# EAGLE design outdoor-sensor (EAGLE 6.5.0)

## Sheet 1 of 8: Pressure Sensor LPS25H Datasheet <http://www.st.com/st-web-ui/static/active/en/resource/technical/document/datasheet/DM00066332.pdf>
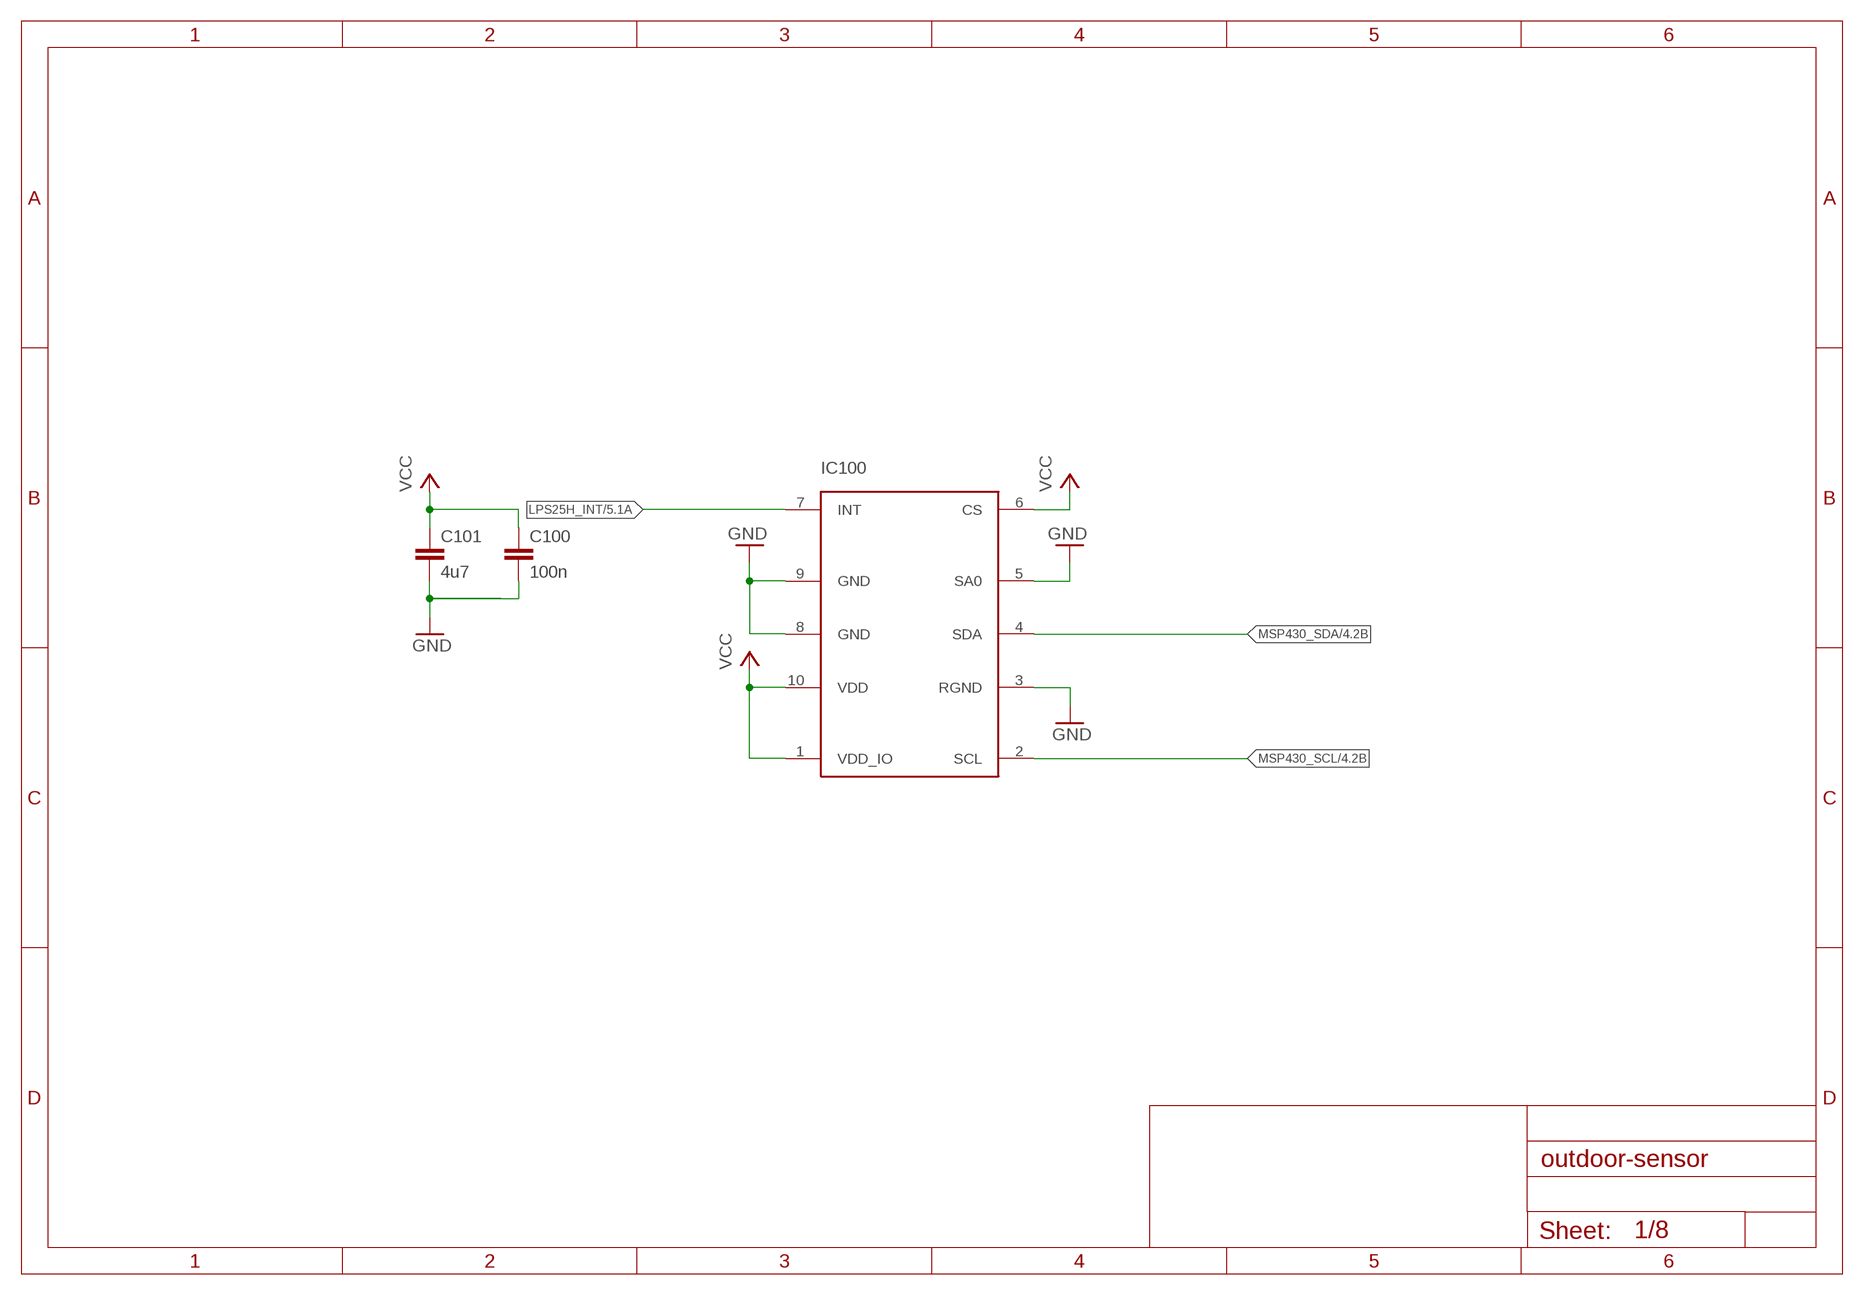
[diagram p0: schematic, sheet 1]

### Parts
C100  100n  C-EUC0603  [C0603]
C101  4u7  C-EUC0603  [C0603]
IC100  LPS25H  [LPS25H]

### Nets
GND: C100.2 C101.2 IC100.3(RGND) IC100.5(SA0) IC100.8(GND) IC100.9(GND) ; also sheet 2,3,4,5,6,7,8
LPS25H_INT: IC100.7(INT) ; also sheet 5
MSP430_SCL: IC100.2(SCL) ; also sheet 4,5,6,8
MSP430_SDA: IC100.4(SDA) ; also sheet 4,5,6,8
VCC: C100.1 C101.1 IC100.1(VDD_IO) IC100.6(CS) IC100.10(VDD) ; also sheet 2,3,4,5,6,8

## Sheet 2 of 8: Charger and Buck BQ25570 Datasheet <http://www.ti.com/lit/ds/symlink/bq25570.pdf>
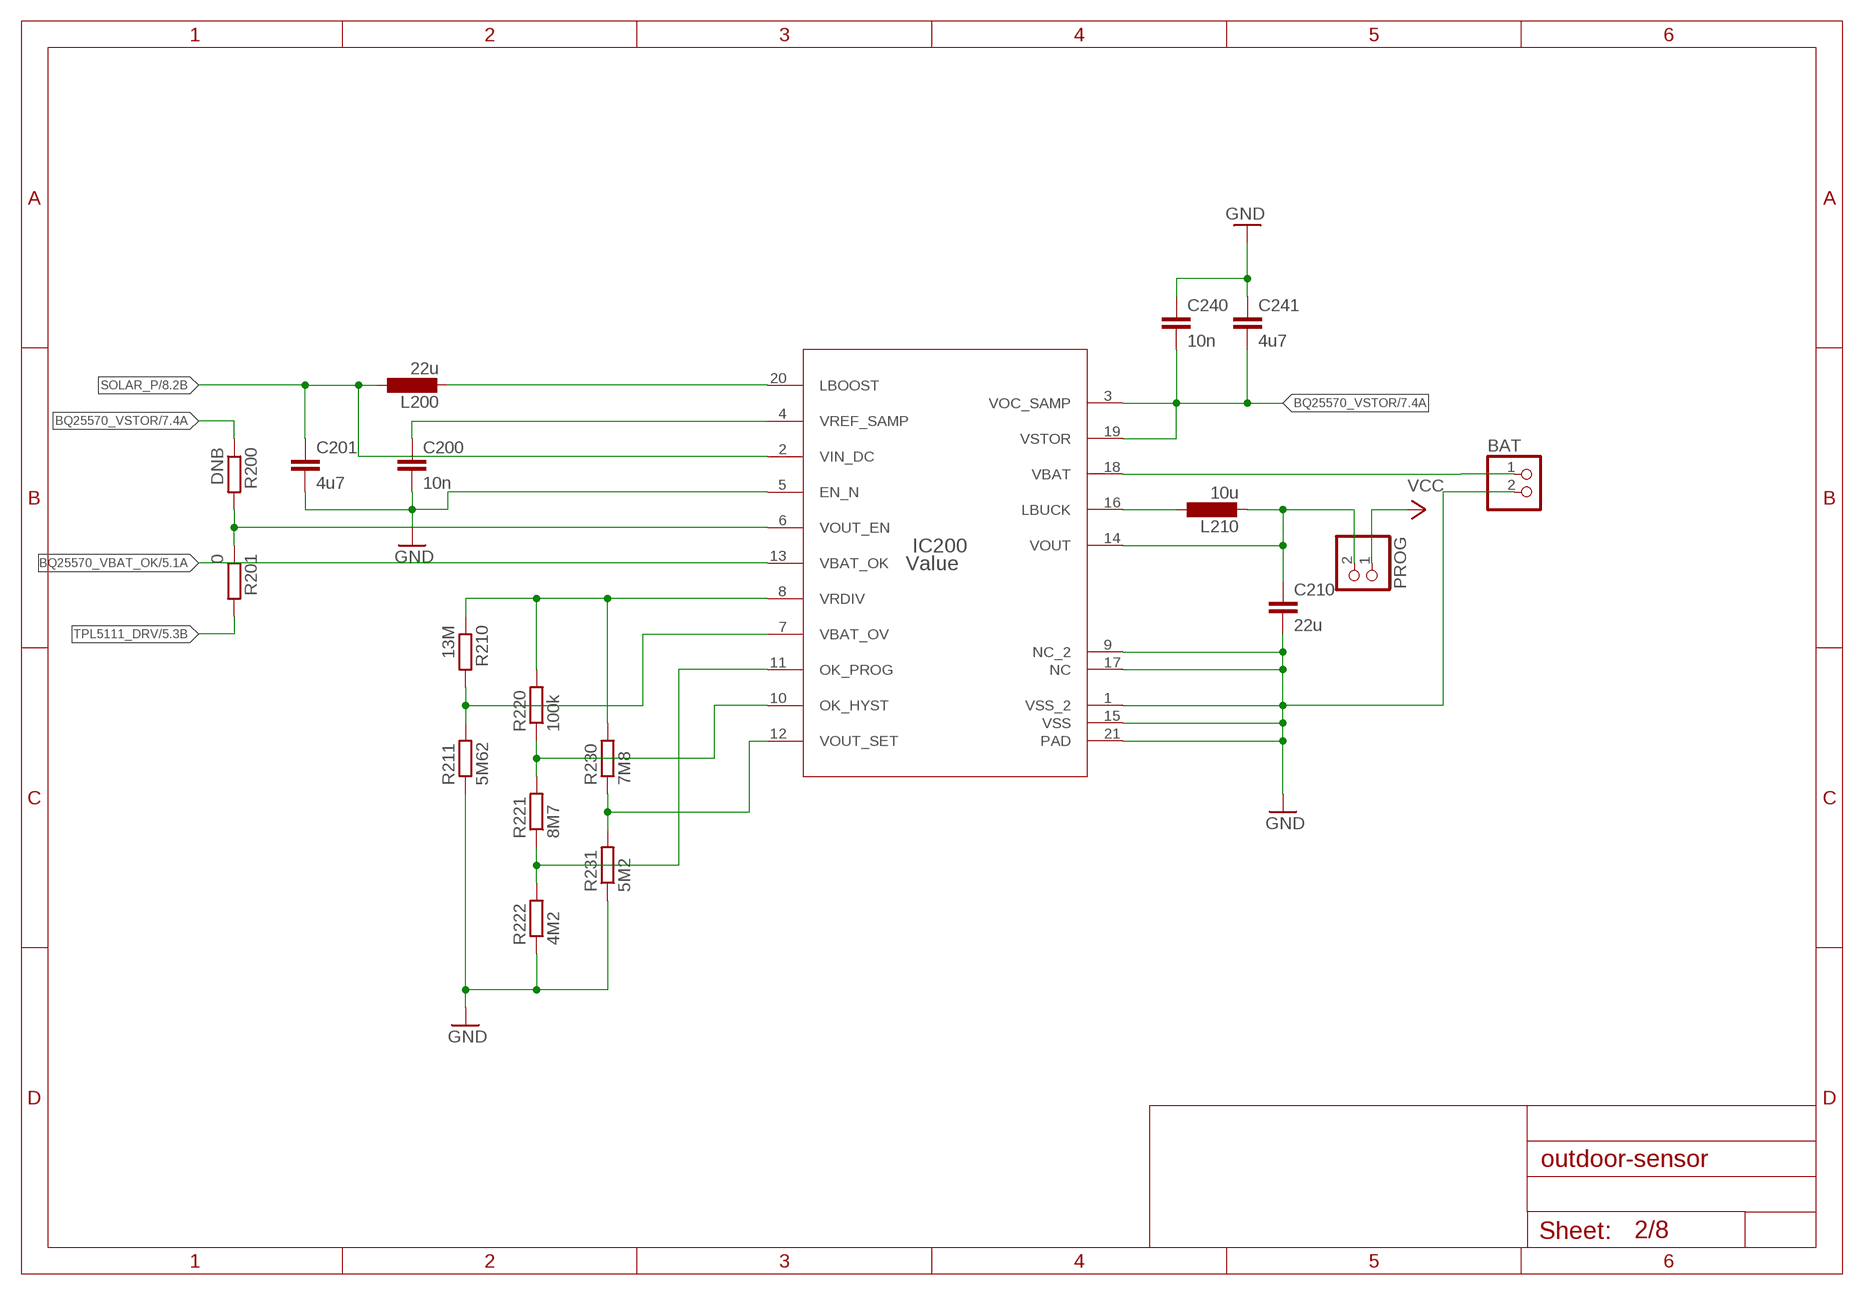
[diagram p1: schematic, sheet 2]

### Parts
!PROG  PINHD-1X2  [1X02]
BAT  PINHD-1X2  [1X02]
C200  10n  C-EUC0603  [C0603]
C201  4u7  C-EUC0603  [C0603]
C210  22u  C-EUC0603  [C0603]
C240  10n  C-EUC0603  [C0603]
C241  4u7  C-EUC0603  [C0603]
IC200  Value  BQ25570RGRR  [RGR0020A]
L200  22u  L-EUL3225P  [L3225P]
L210  10u  L-EUL3225P  [L3225P]
R200  DNB  R-EU_R0603  [R0603]
R201  0  R-EU_R0603  [R0603]
R210  13M  R-EU_R0603  [R0603]
R211  5M62  R-EU_R0603  [R0603]
R220  100k  R-EU_R0603  [R0603]
R221  8M7  R-EU_R0603  [R0603]
R222  4M2  R-EU_R0603  [R0603]
R230  7M8  R-EU_R0603  [R0603]
R231  5M2  R-EU_R0603  [R0603]

### Nets
BQ25570_VBAT_OK: IC200.13(VBAT_OK) ; also sheet 5
BQ25570_VOUT_EN: IC200.6(VOUT_EN) R200.2 R201.1
BQ25570_VSTOR: C240.2 C241.2 IC200.3(VOC_SAMP) IC200.19(VSTOR) R200.1 ; also sheet 7
GND: BAT.2 C200.2 C201.2 C210.2 C240.1 C241.1 IC200.1(VSS_2) IC200.5(EN_N) IC200.9(NC_2) IC200.15(VSS) IC200.17(NC) IC200.21(PAD) R211.1 R222.1 R231.1 ; also sheet 1,3,4,5,6,7,8
N$14: IC200.10(OK_HYST) R220.1 R221.2
N$15: IC200.8(VRDIV) R210.1 R220.2 R230.2
N$16: IC200.7(VBAT_OV) R210.2 R211.2
N$17: IC200.11(OK_PROG) R221.1 R222.2
N$18: IC200.20(LBOOST) L200.2
N$19: C200.1 IC200.4(VREF_SAMP)
N$21: IC200.12(VOUT_SET) R230.1 R231.2
N$22: !PROG.2 C210.1 IC200.14(VOUT) L210.2
N$25: IC200.16(LBUCK) L210.1
N$26: BAT.1 IC200.18(VBAT)
SOLAR_P: C201.1 IC200.2(VIN_DC) L200.1 ; also sheet 8
TPL5111_DRV: R201.2 ; also sheet 5,7
VCC: !PROG.1 ; also sheet 1,3,4,5,6,8

## Sheet 3 of 8: Sub 1-GHz Transceiver CC110L Datasheet <http://www.ti.com/lit/ds/symlink/bq25570.pdf>
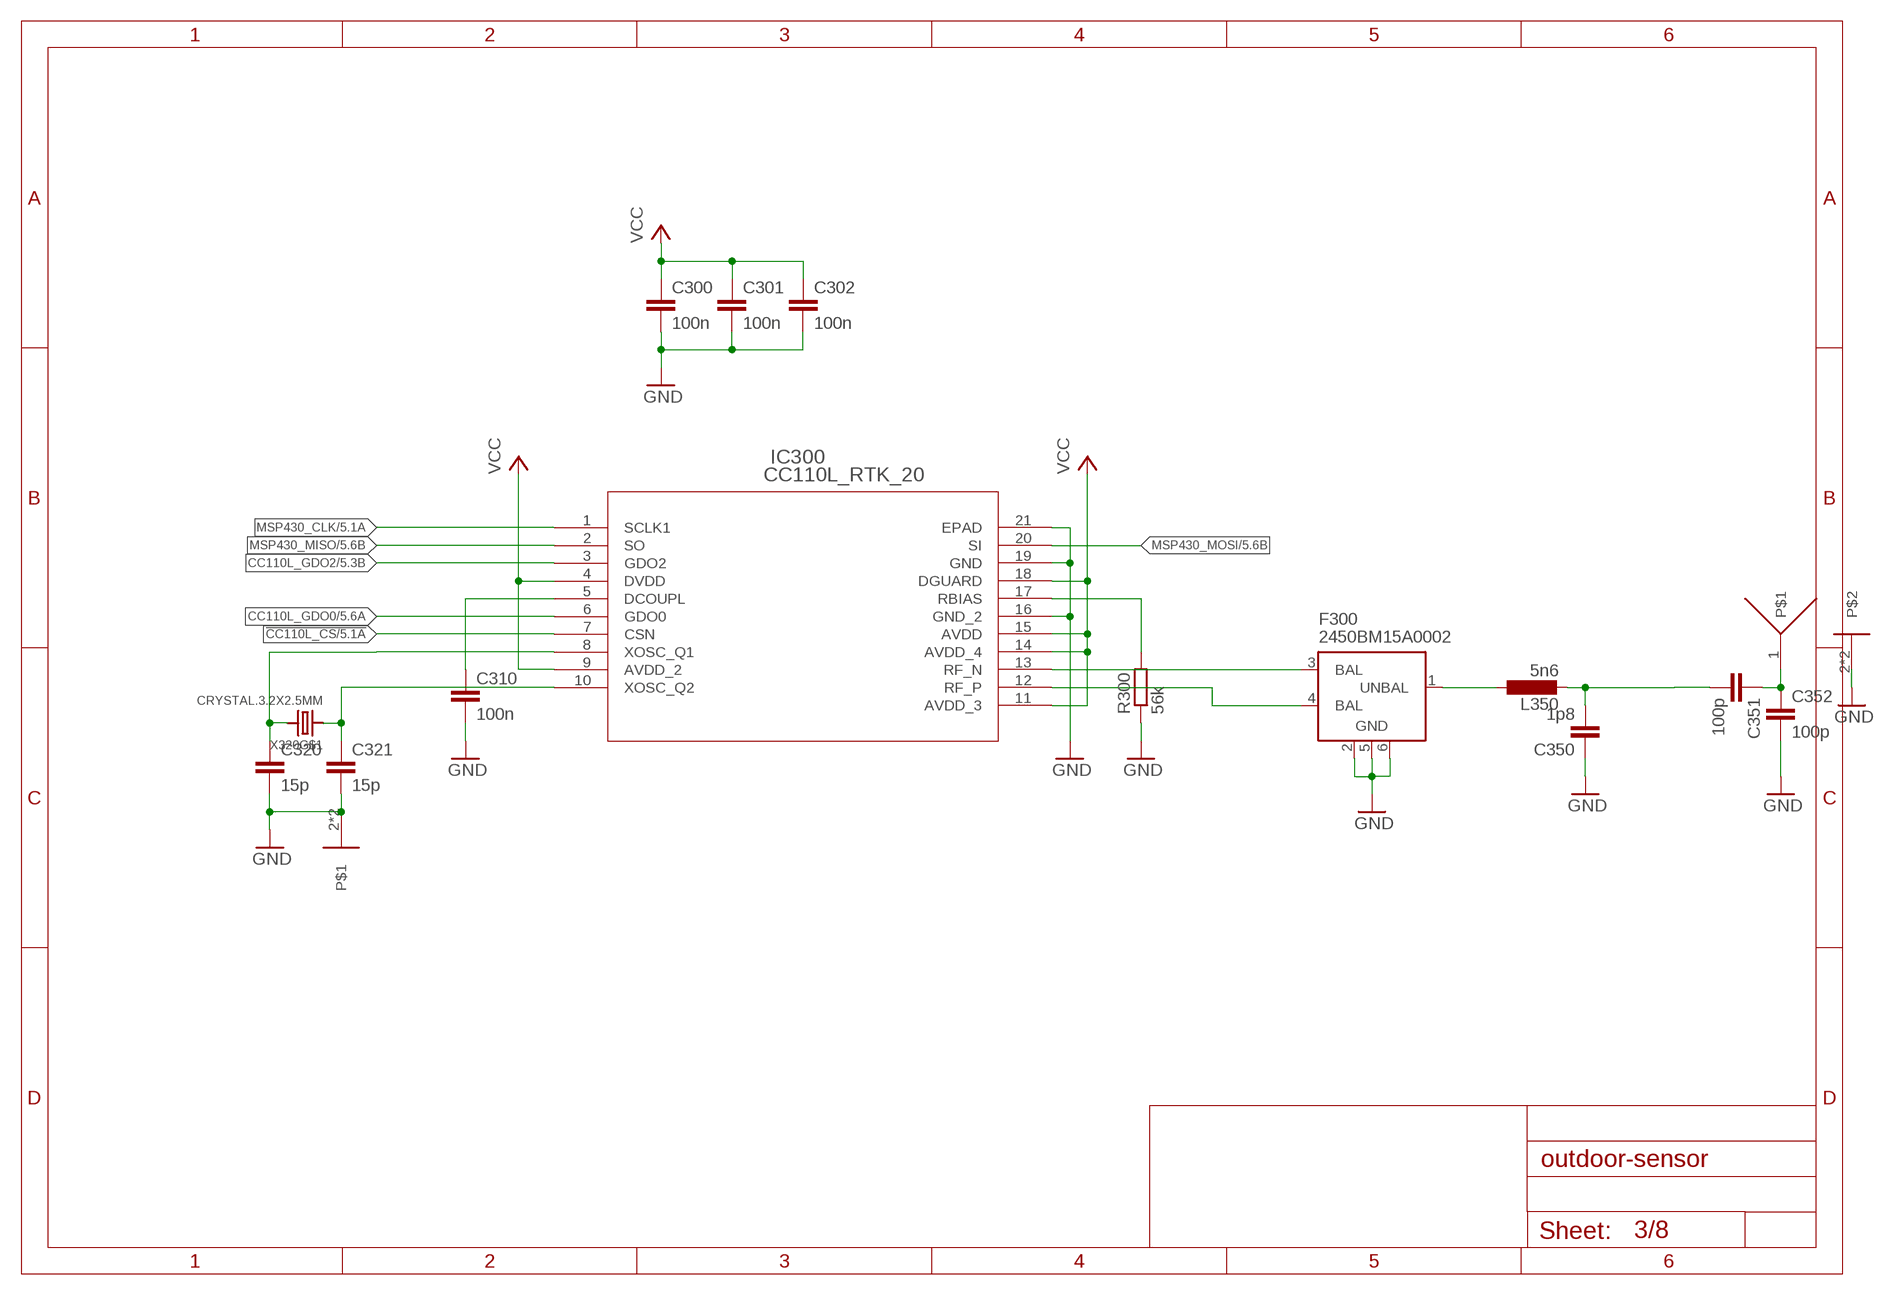
[diagram p2: schematic, sheet 3]

### Parts
C300  100n  C-EUC0603  [C0603]
C301  100n  C-EUC0603  [C0603]
C302  100n  C-EUC0603  [C0603]
C310  100n  C-EUC0603  [C0603]
C320  15p  C-EUC0603  [C0603]
C321  15p  C-EUC0603  [C0603]
C350  1p8  C-EUC0603K  [C0603K]
C351  100p  C-EUC0603  [C0603]
C352  100p  C-EUC0603K  [C0603K]
F300  2450BM15A0002  [2450BM15A0002]
IC300  CC110L_RTK_20  [RTK20_2P4X2P4]
L350  5n6  L-EUL2012C  [L2012C]
R300  56k  R-EU_R0603  [R0603]
U$1  ANTENNA868W3013-INV  [W3013-INV]
X320  CRYSTAL.3.2X2.5MM  [3.2X2.5MM]

### Nets
!CC110L_CS: IC300.7(CSN) ; also sheet 5
CC110L_GDO0: IC300.6(GDO0) ; also sheet 5
CC110L_GDO2: IC300.3(GDO2) ; also sheet 5
GND: C300.2 C301.2 C302.2 C310.2 C320.2 C321.2 C350.1 C352.2 F300.2(GND) F300.5(GND) F300.6(GND) IC300.16(GND_2) IC300.19(GND) IC300.21(EPAD) R300.1 U$1.2 U$1.3 X320.2 X320.4 ; also sheet 1,2,4,5,6,7,8
MSP430_CLK: IC300.1(SCLK1) ; also sheet 5
MSP430_MISO: IC300.2(SO) ; also sheet 5
MSP430_MOSI: IC300.20(SI) ; also sheet 5
N$1: C351.1 C352.1 U$1.1
N$2: F300.1(UNBAL) L350.1
N$29: C320.1 IC300.8(XOSC_Q1) X320.3
N$34: F300.3(BAL) IC300.13(RF_N)
N$35: F300.4(BAL) IC300.12(RF_P)
N$36: C350.2 C351.2 L350.2
N$40: C310.1 IC300.5(DCOUPL)
N$41: IC300.17(RBIAS) R300.2
N$49: C321.1 IC300.10(XOSC_Q2) X320.1
VCC: C300.1 C301.1 C302.1 IC300.4(DVDD) IC300.9(AVDD_2) IC300.11(AVDD_3) IC300.14(AVDD_4) IC300.15(AVDD) IC300.18(DGUARD) ; also sheet 1,2,4,5,6,8

## Sheet 4 of 8: Humidity/Temperature Sensor HDC1000 Datasheet <http://www.ti.com/lit/ds/symlink/hdc1000.pdf>
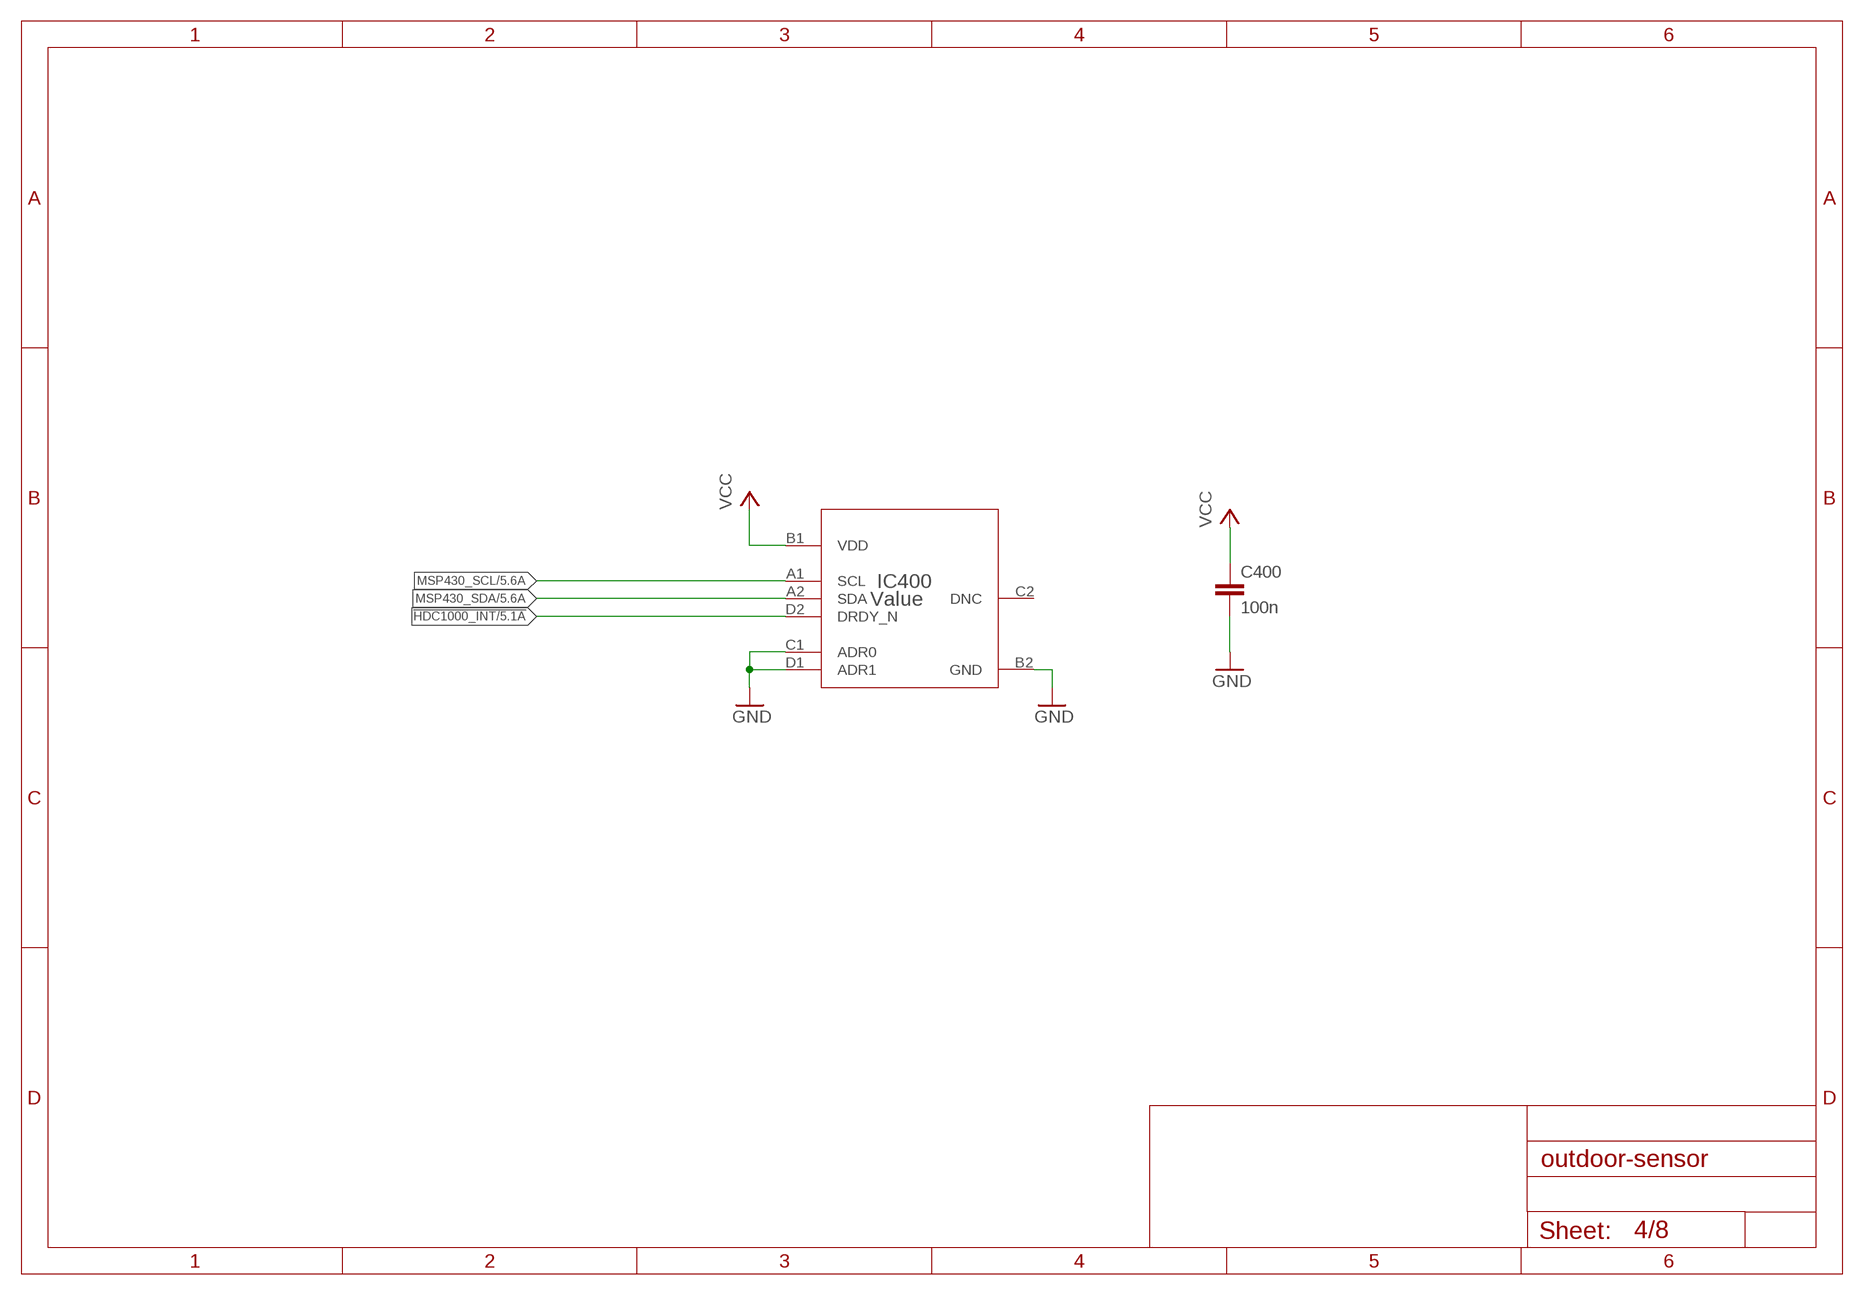
[diagram p3: schematic, sheet 4]

### Parts
C400  100n  C-EUC0603  [C0603]
IC400  Value  HDC1000YPAR  [YPA0008AGAE]

### Nets
!HDC1000_INT: IC400.D2(DRDY_N) ; also sheet 5
GND: C400.2 IC400.B2(GND) IC400.C1(ADR0) IC400.D1(ADR1) ; also sheet 1,2,3,5,6,7,8
MSP430_SCL: IC400.A1(SCL) ; also sheet 1,5,6,8
MSP430_SDA: IC400.A2(SDA) ; also sheet 1,5,6,8
VCC: C400.1 IC400.B1(VDD) ; also sheet 1,2,3,5,6,8
Unconnected: IC400.C2(DNC)

## Sheet 5 of 8: Mikrocontroller
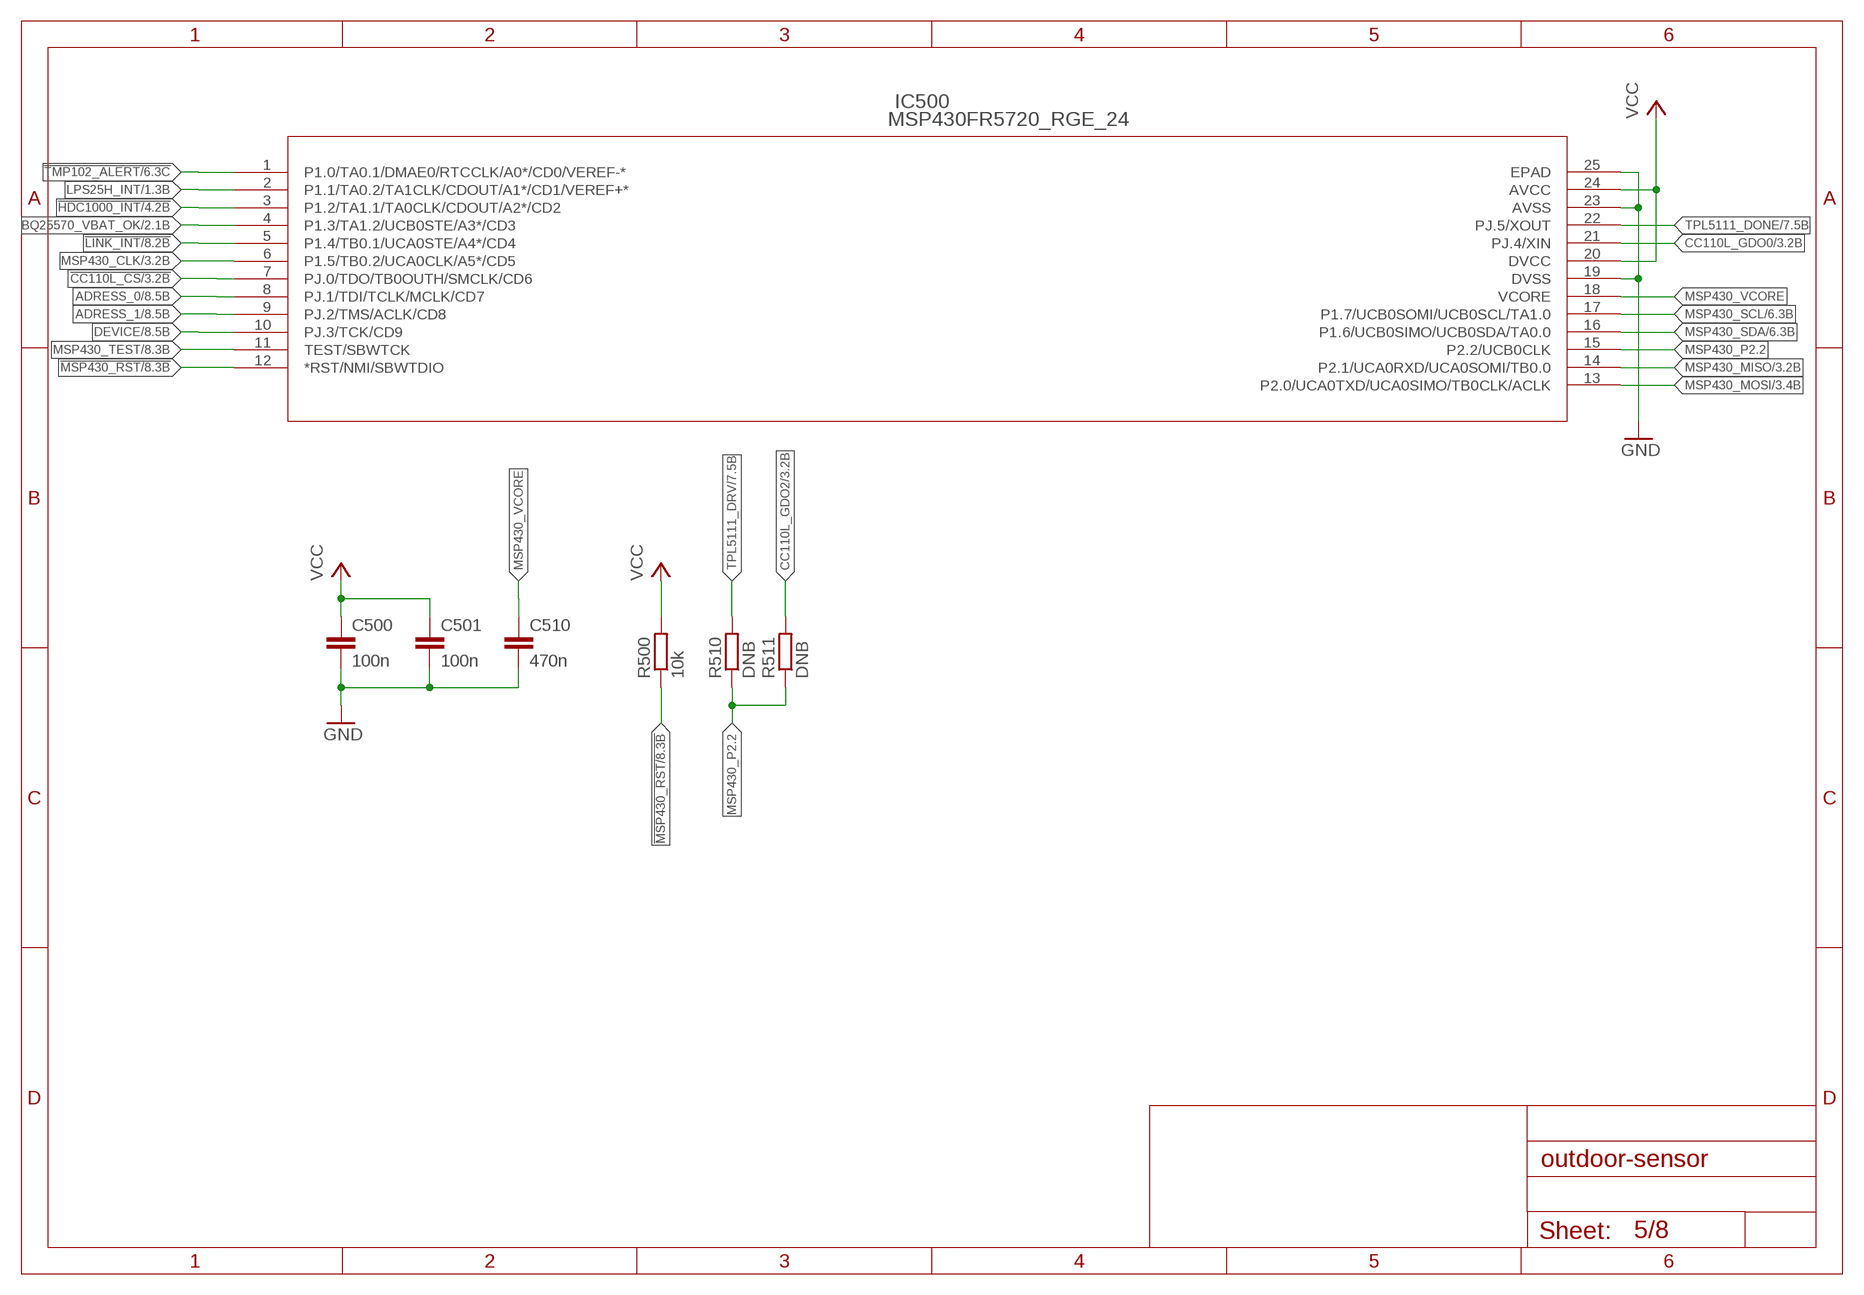
[diagram p4: schematic, sheet 5]

### Parts
C500  100n  C-EUC0603  [C0603]
C501  100n  C-EUC0603  [C0603]
C510  470n  C-EUC0603  [C0603]
IC500  MSP430FR5720_RGE_24  [RGE24_2P1X2P1]
R500  10k  R-EU_R0603  [R0603]
R510  DNB  R-EU_R0603  [R0603]
R511  DNB  R-EU_R0603  [R0603]

### Nets
!CC110L_CS: IC500.7(PJ.0/TDO/TB0OUTH/SMCLK/CD6) ; also sheet 3
!HDC1000_INT: IC500.3(P1.2/TA1.1/TA0CLK/CDOUT/A2*/CD2) ; also sheet 4
!LINK_INT: IC500.5(P1.4/TB0.1/UCA0STE/A4*/CD4) ; also sheet 8
!MSP430_RST: IC500.12(*RST/NMI/SBWTDIO) R500.1 ; also sheet 8
!TMP102_ALERT: IC500.1(P1.0/TA0.1/DMAE0/RTCCLK/A0*/CD0/VEREF-*) ; also sheet 6
ADRESS_0: IC500.8(PJ.1/TDI/TCLK/MCLK/CD7) ; also sheet 8
ADRESS_1: IC500.9(PJ.2/TMS/ACLK/CD8) ; also sheet 8
BQ25570_VBAT_OK: IC500.4(P1.3/TA1.2/UCB0STE/A3*/CD3) ; also sheet 2
CC110L_GDO0: IC500.21(PJ.4/XIN) ; also sheet 3
CC110L_GDO2: R511.2 ; also sheet 3
DEVICE: IC500.10(PJ.3/TCK/CD9) ; also sheet 8
GND: C500.2 C501.2 C510.2 IC500.19(DVSS) IC500.23(AVSS) IC500.25(EPAD) ; also sheet 1,2,3,4,6,7,8
LPS25H_INT: IC500.2(P1.1/TA0.2/TA1CLK/CDOUT/A1*/CD1/VEREF+*) ; also sheet 1
MSP430_CLK: IC500.6(P1.5/TB0.2/UCA0CLK/A5*/CD5) ; also sheet 3
MSP430_MISO: IC500.14(P2.1/UCA0RXD/UCA0SOMI/TB0.0) ; also sheet 3
MSP430_MOSI: IC500.13(P2.0/UCA0TXD/UCA0SIMO/TB0CLK/ACLK) ; also sheet 3
MSP430_P2.2: IC500.15(P2.2/UCB0CLK) R510.1 R511.1
MSP430_SCL: IC500.17(P1.7/UCB0SOMI/UCB0SCL/TA1.0) ; also sheet 1,4,6,8
MSP430_SDA: IC500.16(P1.6/UCB0SIMO/UCB0SDA/TA0.0) ; also sheet 1,4,6,8
MSP430_TEST: IC500.11(TEST/SBWTCK) ; also sheet 8
MSP430_VCORE: C510.1 IC500.18(VCORE)
TPL5111_DONE: IC500.22(PJ.5/XOUT) ; also sheet 7
TPL5111_DRV: R510.2 ; also sheet 2,7
VCC: C500.1 C501.1 IC500.20(DVCC) IC500.24(AVCC) R500.2 ; also sheet 1,2,3,4,6,8

## Sheet 6 of 8: Temperature Sensor TMP102-Q1 Datasheet <http://www.ti.com/lit/ds/symlink/tmp102-q1.pdf>
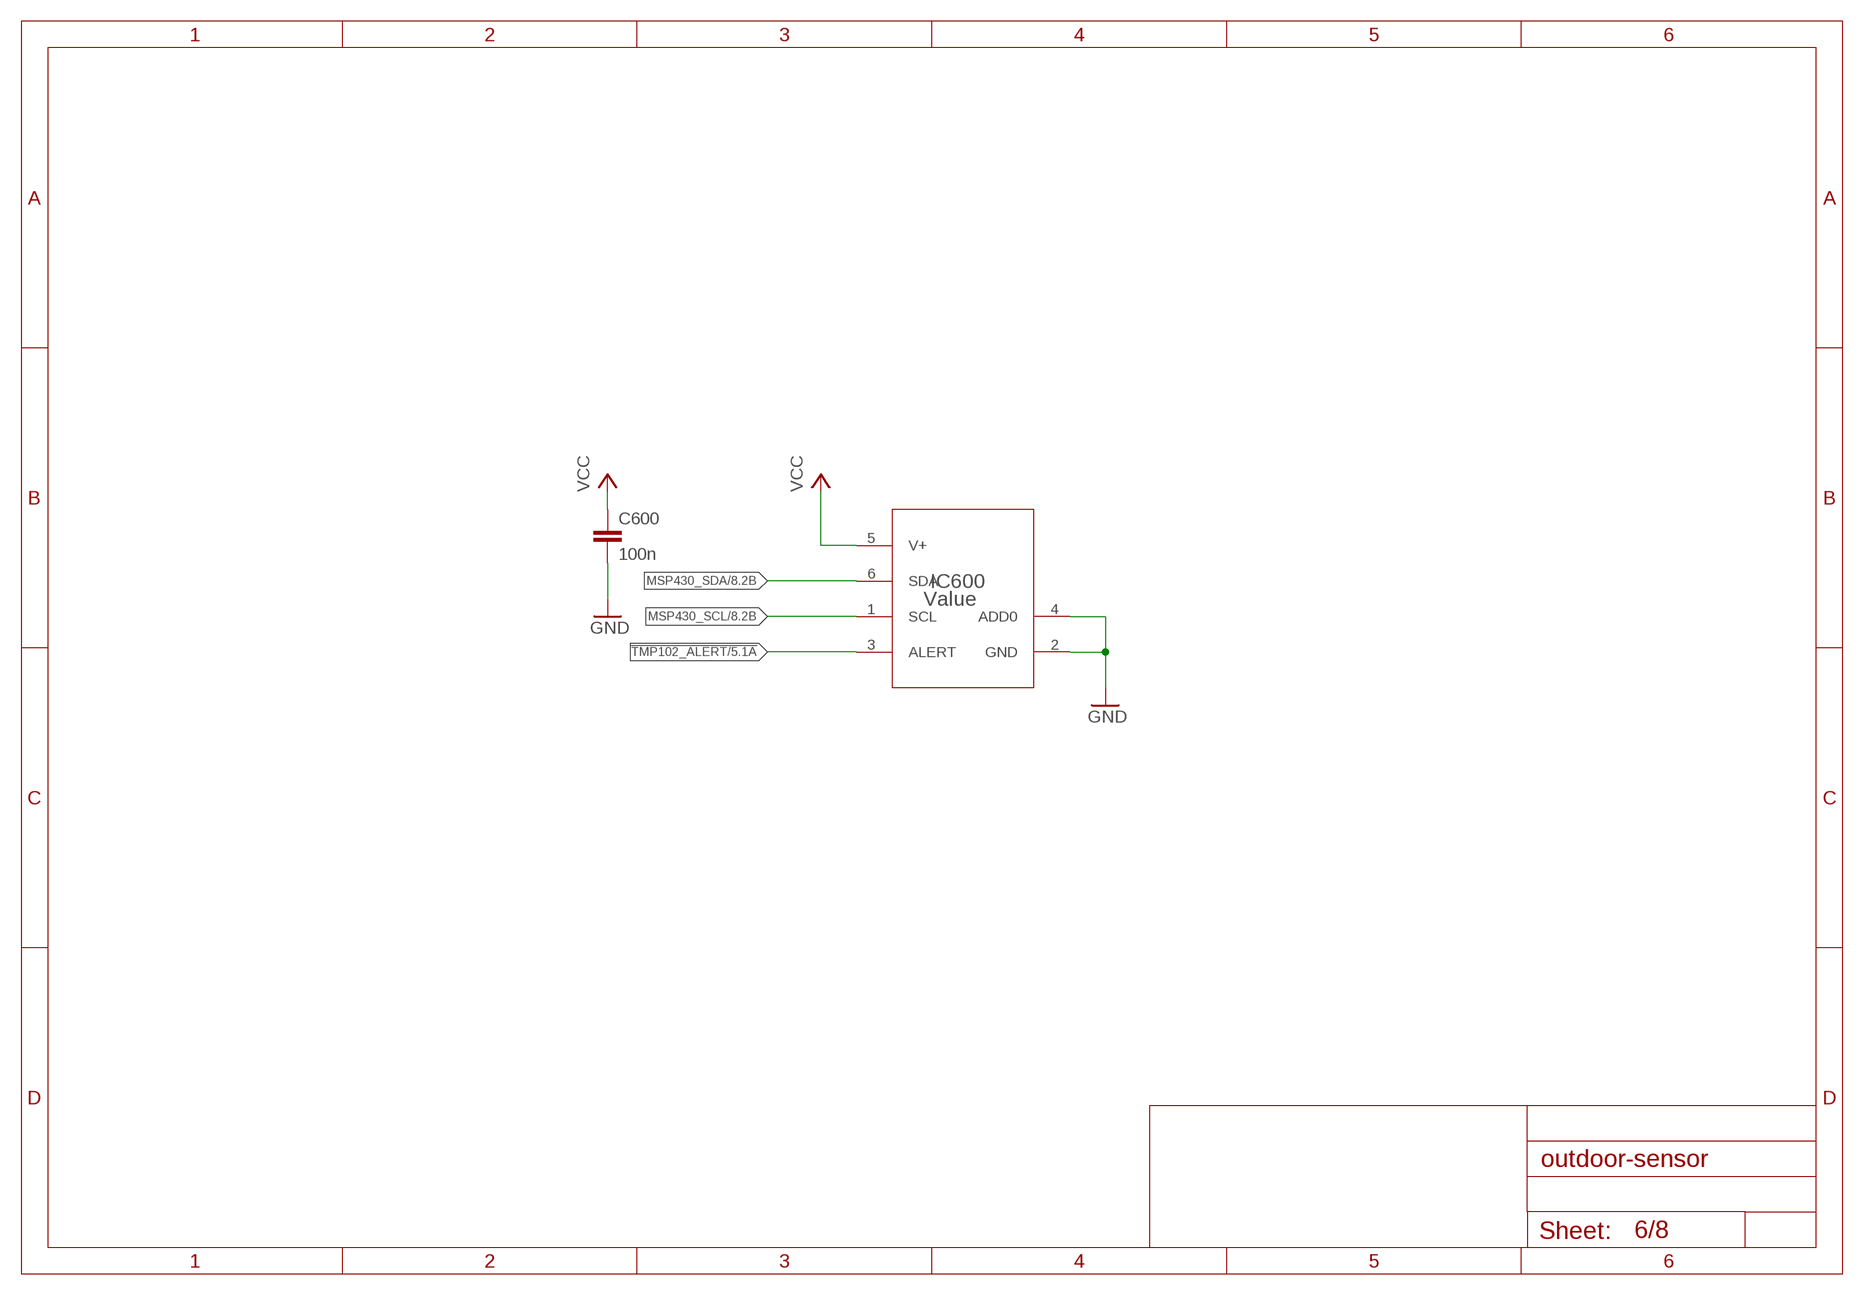
[diagram p5: schematic, sheet 6]

### Parts
C600  100n  C-EUC0603  [C0603]
IC600  Value  TMP102AQDRLRQ1  [DRL0006A]

### Nets
!TMP102_ALERT: IC600.3(ALERT) ; also sheet 5
GND: C600.2 IC600.2(GND) IC600.4(ADD0) ; also sheet 1,2,3,4,5,7,8
MSP430_SCL: IC600.1(SCL) ; also sheet 1,4,5,8
MSP430_SDA: IC600.6(SDA) ; also sheet 1,4,5,8
VCC: C600.1 IC600.5(V+) ; also sheet 1,2,3,4,5,8

## Sheet 7 of 8: Nano low power timer TPL5010 Datasheet <http://www.ti.com/lit/ds/symlink/tpl5010.pdf>
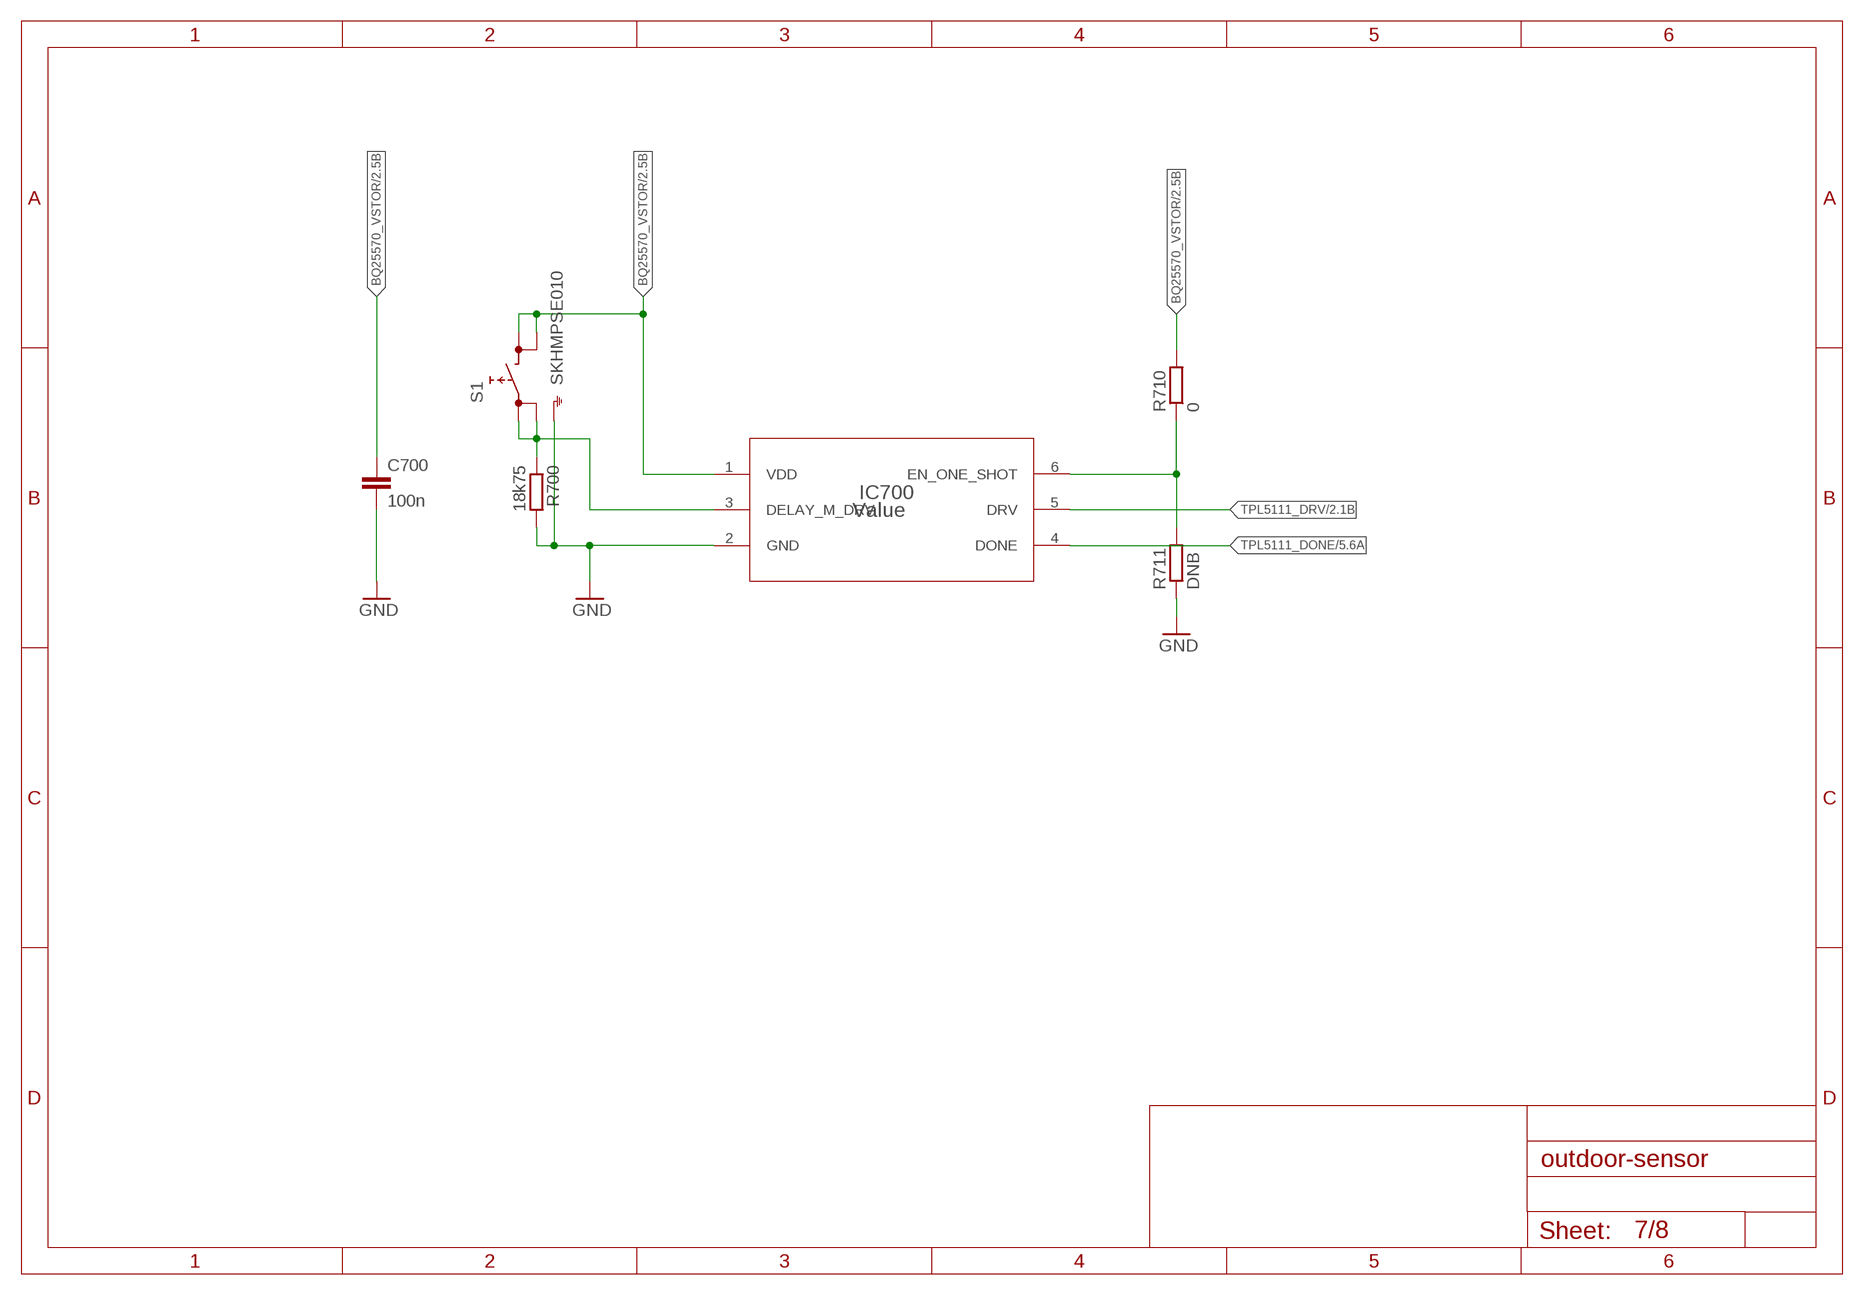
[diagram p6: schematic, sheet 7]

### Parts
C700  100n  C-EUC0603  [C0603]
IC700  Value  TPL5110DDCR  [DDC0006A_N]
R700  18k75  R-EU_R0603  [R0603]
R710  0  R-EU_R0603  [R0603]
R711  DNB  R-EU_R0603  [R0603]
S1  SKHMPSE010  [SKHMPXE010]

### Nets
BQ25570_VSTOR: C700.1 IC700.1(VDD) R710.2 S1.3(2.1) S1.4(2.2) ; also sheet 2
GND: C700.2 IC700.2(GND) R700.2 R711.1 S1.5(SH) ; also sheet 1,2,3,4,5,6,8
N$7: IC700.3(DELAY_M_DRV) R700.1 S1.1(1.1) S1.2(1.2)
TPL5010_RST_N: IC700.6(EN_ONE_SHOT) R710.1 R711.2
TPL5111_DONE: IC700.4(DONE) ; also sheet 5
TPL5111_DRV: IC700.5(DRV) ; also sheet 2,5

## Sheet 8 of 8: Connectors
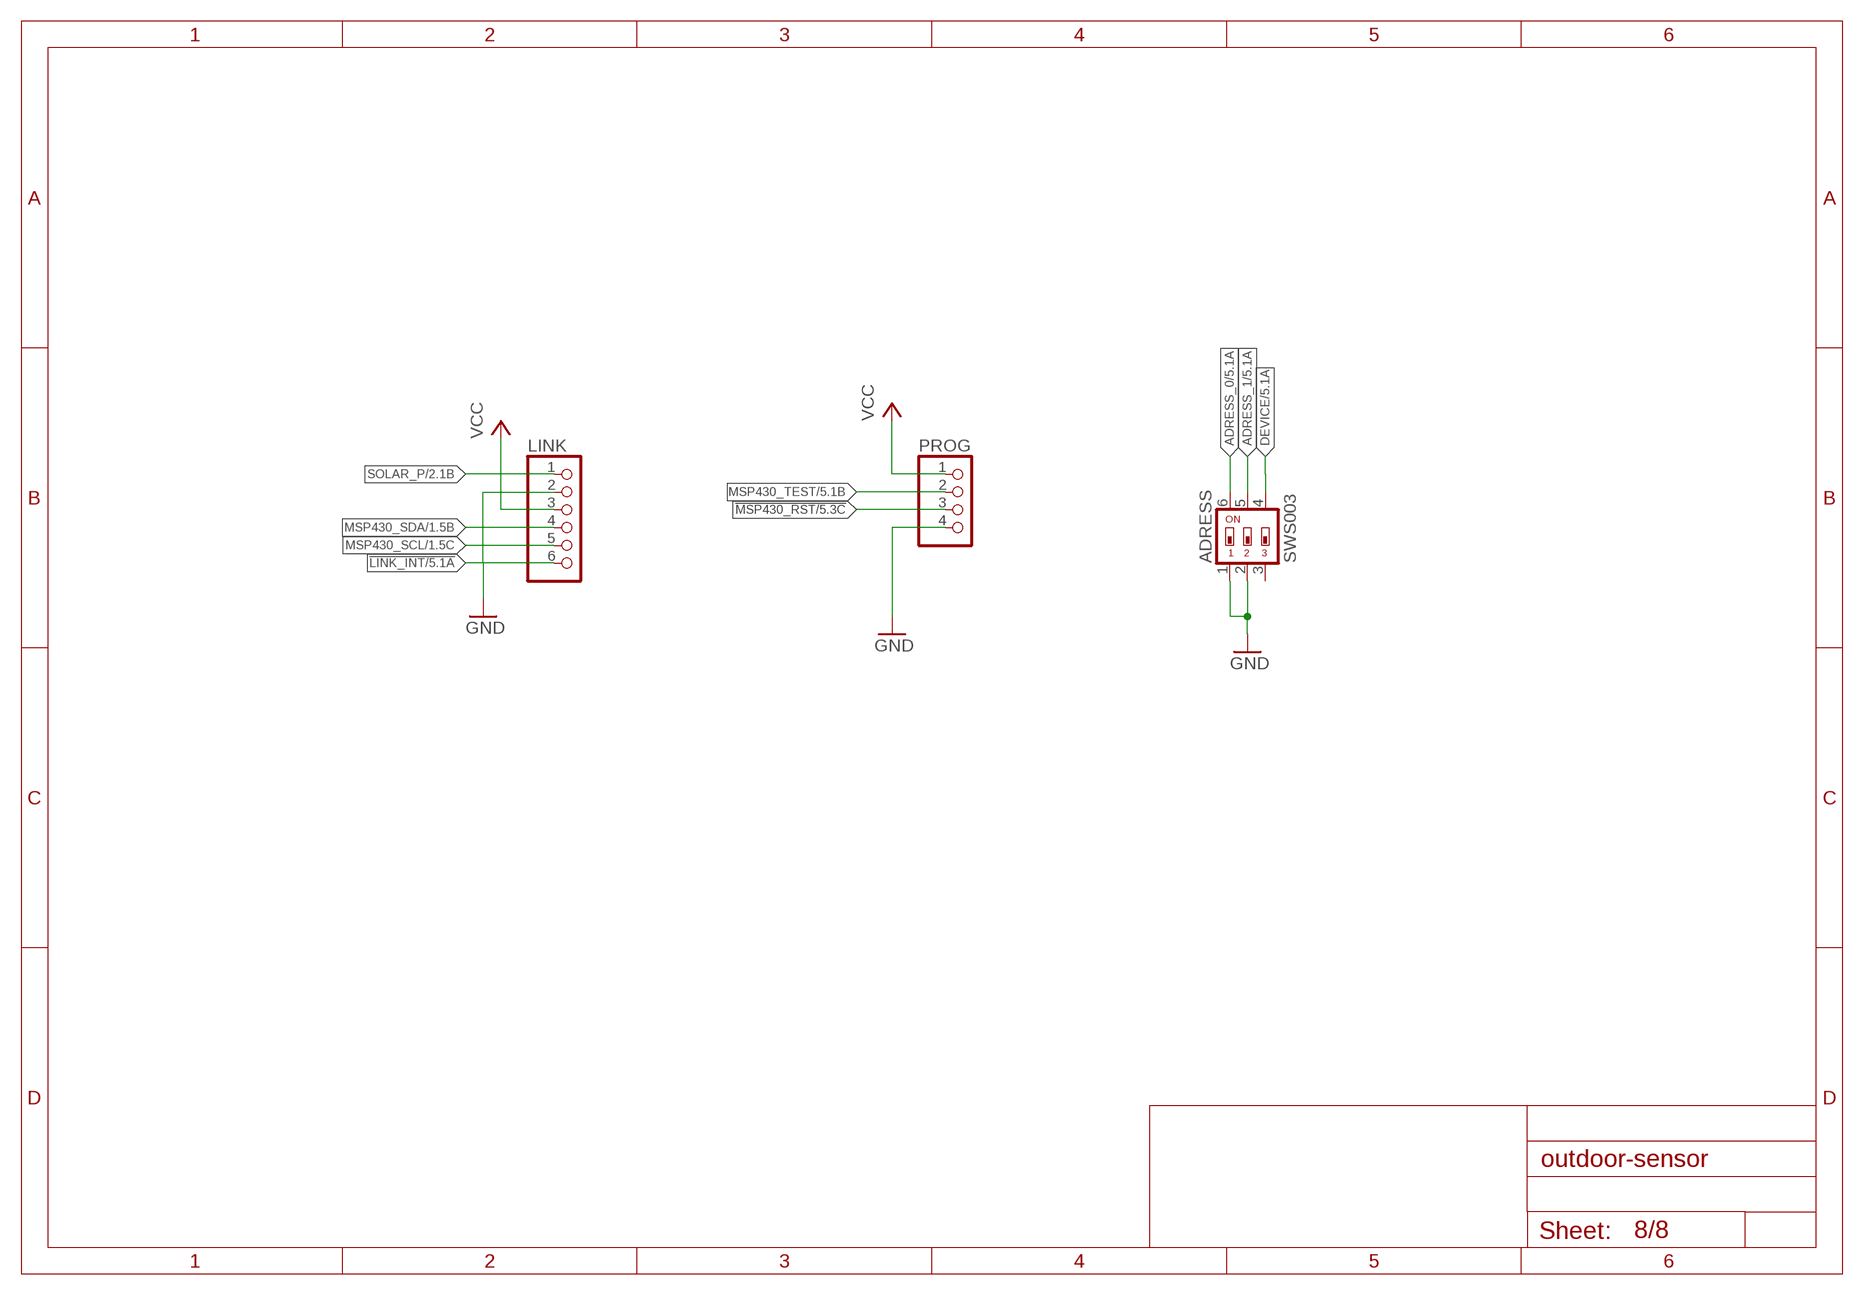
[diagram p7: schematic, sheet 8]

### Parts
ADRESS  SWS003  [SMS-003]
LINK  PINHD-1X6  [1X06]
PROG  PINHD-1X4  [1X04]

### Nets
!LINK_INT: LINK.6 ; also sheet 5
!MSP430_RST: PROG.3 ; also sheet 5
ADRESS_0: ADRESS.6 ; also sheet 5
ADRESS_1: ADRESS.5 ; also sheet 5
DEVICE: ADRESS.4 ; also sheet 5
GND: ADRESS.1 ADRESS.2 LINK.2 PROG.4 ; also sheet 1,2,3,4,5,6,7
MSP430_SCL: LINK.5 ; also sheet 1,4,5,6
MSP430_SDA: LINK.4 ; also sheet 1,4,5,6
MSP430_TEST: PROG.2 ; also sheet 5
SOLAR_P: LINK.1 ; also sheet 2
VCC: LINK.3 PROG.1 ; also sheet 1,2,3,4,5,6
Unconnected: ADRESS.3

## Library data of the parts
!PROG BAT = pinhead:PINHD-1X2: PIN HEADER
ADRESS = smd-special:SWS003: SMD Dip Switch 3 pol.
C100 C101 C200 C201 C210 C240 C241 C300-C302 C310 C320 C321 C350-C352 C400 C500 C501 C510 C600 C700 = rcl:C-EU: CAPACITOR, European symbol
F300 = johanson-technology:2450BM15A0002: 2.45 GHz Impedance Matched Balun-Filter For TI CC253X/CC2540 Chipset family Data sheet <http://www.johansontechnology.com/images/stories/ip/baluns/balun_filter_combo_matched_2450bm15a0002_v8.pdf>
IC100 = weather_station:LPS25H: ST-Micro Piezoresistive pressure sensor; DIGIKEY: 497-15070-1-ND
IC200 = weather_station:BQ25570RGRR; ALTERNATEPARTNUMBER: BQ25570RGRT; APPLICATION_BUILDNUMBER: *; COMPTYPE: IC; MANUFACTURER: Texas Instruments; MOUNTTYPE: SMT; PACKAGEREFERENCE: RGR0020A; PARTNUMBER: BQ25570RGRR; PIN_COUNT: 21; REFDES: RefDes; ROHS: Y; TYPE: TYPE
IC300 = weather_station:CC110L_RTK_20; DATASHEETURL: http://www.ti.com/lit/gpn/CC110L; DESCRIPTION: Value Line Transceiver; FAMILY_NAME: SUB-1 GHZ; GENERIC_PART_NUMBER: CC110L; INDUSTRY_STD_PKG_TYPE: VQFN; MANUFACTURER: Texas Instruments; PACKAGE_DESIGNATOR: RTK; PIN_COUNT: 20
IC400 = weather_station:HDC1000YPAR; ALTERNATEPARTNUMBER: HDC1000YPAT; COMPTYPE: IC; MANUFACTURER: Texas Instruments; MOUNTTYPE: SMT; PACKAGEREFERENCE: YPA0008AGAE; PARTNUMBER: HDC1000YPAR; PIN_COUNT: 8; REFDES: RefDes; ROHS: Y; TYPE: TYPE
IC500 = weather_station:MSP430FR5720_RGE_24; DATASHEETURL: http://www.ti.com/lit/gpn/MSP430FR5720; DESCRIPTION: MSP430FR573x,MSP430FR572x Mixed Signal Microcontroller; FAMILY_NAME: FRAM Series; GENERIC_PART_NUMBER: MSP430FR5720; INDUSTRY_STD_PKG_TYPE: VQFN; MANUFACTURER: Texas Instruments; MANUFACTURER_PART_NUMBER: msp430fr5720_rge_24; PACKAGE_DESIGNATOR: RGE; PIN_COUNT: 24; VENDOR: Texas Instruments
IC600 = weather_station:TMP102AQDRLRQ1; COMPTYPE: IC; MANUFACTURER: Texas Instruments; MOUNTTYPE: SMT; PACKAGEREFERENCE: DRL0006A; PARTNUMBER: TMP102AQDRLRQ1; PIN_COUNT: 6; REFDES: RefDes; ROHS: Y; TYPE: TYPE
IC700 = weather_station:TPL5110DDCR; COMPTYPE: IC; MANUFACTURER: Texas Instruments; MOUNTTYPE: SMT; PACKAGEREFERENCE: DDC0006A; PARTNUMBER: TPL5110DDC; PIN_COUNT: 6; REFDES: RefDes; ROHS: Y; TYPE: TYPE
L200 L210 L350 = rcl:L-EU: INDUCTOR, European symbol
LINK = pinhead:PINHD-1X6: PIN HEADER
PROG = pinhead:PINHD-1X4: PIN HEADER
R200 R201 R210 R211 R220-R222 R230 R231 R300 R500 R510 R511 R700 R710 R711 = rcl:R-EU_: RESISTOR, European symbol
S1 = switch:SKHMP*E010: 6.2 X 6.5mm TACT Switch (SMD) Source: http://www3.alps.co.jp/WebObjects/catalog.woa/PDF/E/Switch/Tact/SKHM/SKHM.PDF
U$1 = weather_station:ANTENNA868
X320 = abracon:CRYSTAL

## Board
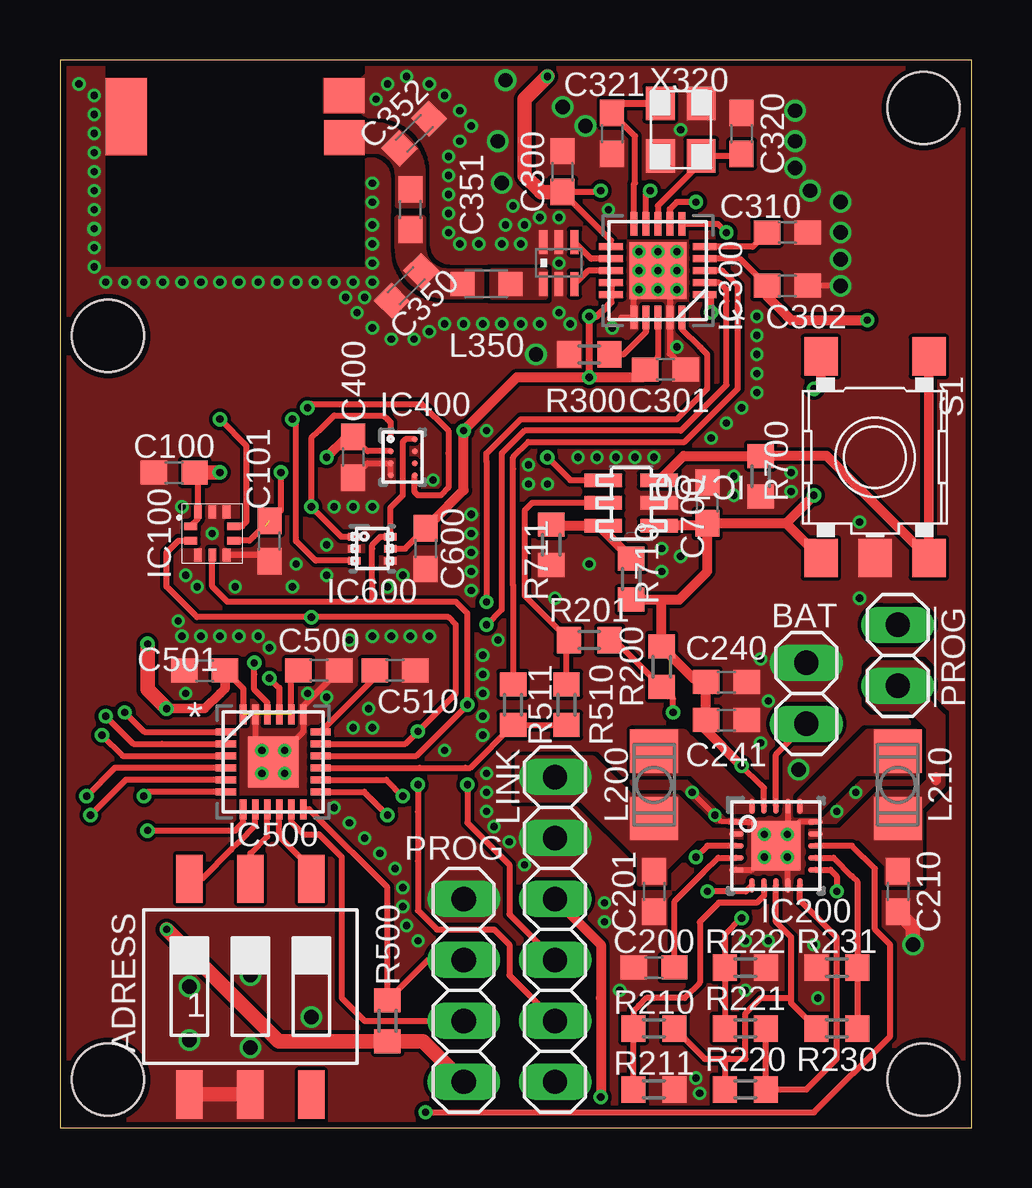
[diagram p8: board, top side]
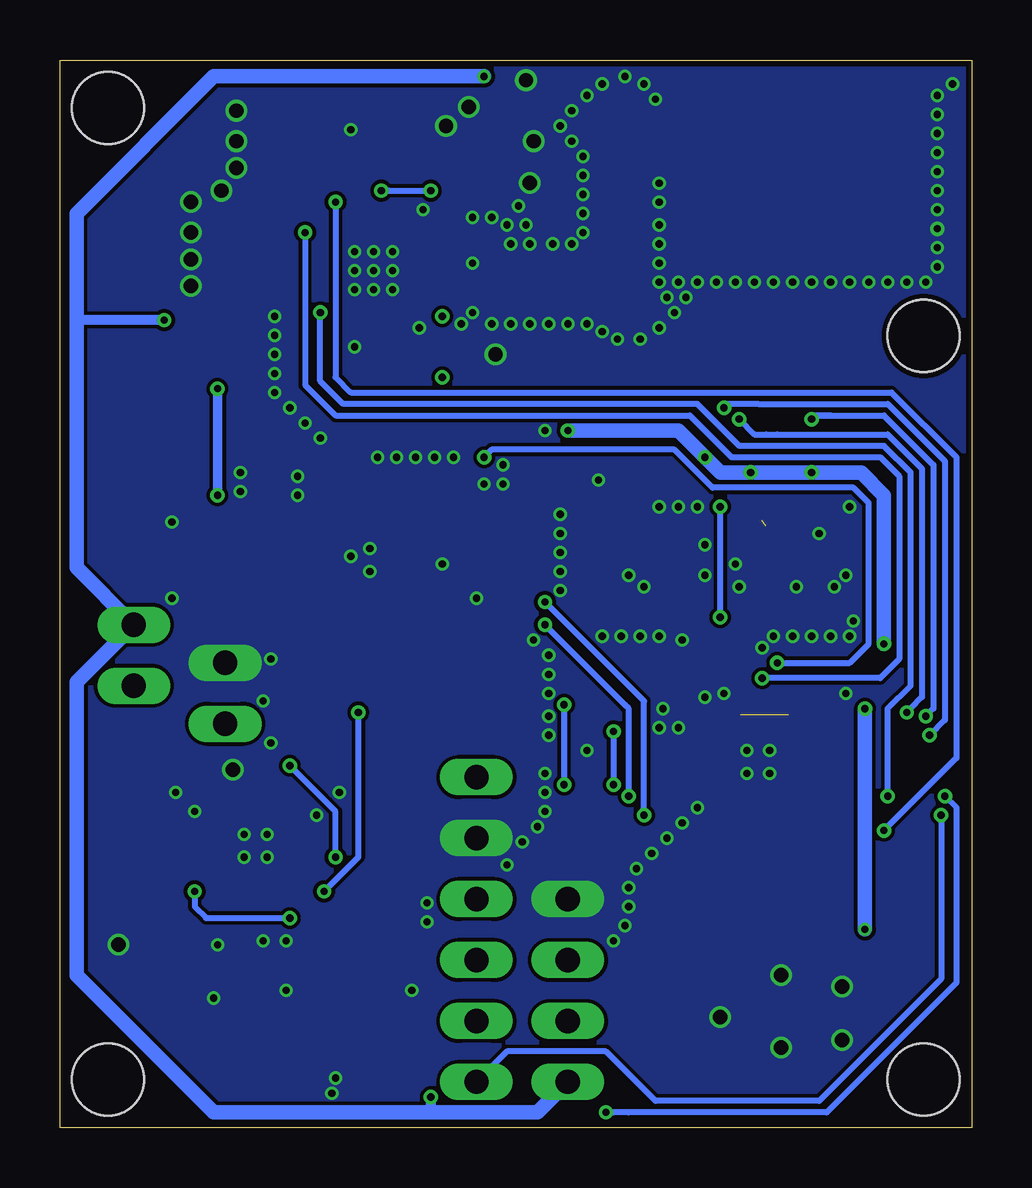
[diagram p9: board, bottom side, seen from below]

Size 38 x 44.5 mm. Coordinates in mm from the lower left corner, seen from the top.
Outline: 0,0 38,0 38,44.5 0,44.5 0,0
Copper layers (1*16): Top 0.018mm / dielectric 1.55mm / Bottom 0.018mm
Design rules "eC_2Layer_PClass6_BaseCopperO18_eCDefault *": minimum track width 0.15mm, minimum drill 0.3mm, track to track 0.15mm, track to pad 0.15mm, pad to pad 0.15mm, via to via 0.15mm, smd to smd 0.15mm, copper to edge 0.25mm, drill to drill 0.35mm, minimum pad ring 0.175mm, minimum via ring 0.125mm, stop-mask expansion 0mil, vias tented up to drill 0.45mm, thermal gap 0.2mm
Holes 3 mm at 2,2 36,2 36,42.5 2,33

### Footprints (pad centres in the part's own frame; a part is rotated, then mirrored left to right if it is on the bottom)
1X02 = drill 1.016 long: 1 -1.27,0; 2 1.27,0
SMS-003 = smd 1.092 x 2.007: 1 -2.54,-4.496; 2 0,-4.496; 3 2.54,-4.496; 4 2.54,4.496; 5 0,4.496; 6 -2.54,4.496
C0603 = smd 1.1 x 1: 1 -0.85,0; 2 0.85,0
C0603K = smd 1.05 x 1.08: 1 -0.875,0; 2 0.875,0
2450BM15A0002 = smd 0.35 x 1: 1 -0.65,-0.875; 2 0,-0.875; 3 0.65,-0.875; 4 0.65,0.875; 5 0,0.875; 6 -0.65,0.875
LPS25H = smd 0.32 x 0.55: 1 -0.3,-0.9; 2 0.3,-0.9; 6 0.3,0.9; 7 -0.3,0.9 | smd 0.55 x 0.32: 3 0.9,-0.6; 4 0.9,0; 5 0.9,0.6; 8 -0.9,0.6; 9 -0.9,0; 10 -0.9,-0.6
RGR0020A = smd 0.61 x 0.229: 1 -1.65,1; 2 -1.65,0.5; 3 -1.65,0; 4 -1.65,-0.5; 5 -1.65,-1; 11 1.65,-1; 12 1.65,-0.5; 13 1.65,0; 14 1.65,0.5; 15 1.65,1 | smd 0.229 x 0.61: 6 -1,-1.65; 7 -0.5,-1.65; 8 0,-1.65; 9 0.5,-1.65; 10 1,-1.65; 16 1,1.65; 17 0.5,1.65; 18 0,1.65; 19 -0.5,1.65; 20 -1,1.65 | smd 2.057 x 2.057: 21 0,0
RTK20_2P4X2P4 = smd 0.991 x 0.279: 1 -1.95,1; 2 -1.95,0.5; 3 -1.95,0; 4 -1.95,-0.5; 5 -1.95,-1; 11 1.95,-1; 12 1.95,-0.5; 13 1.95,0; 14 1.95,0.5; 15 1.95,1 | smd 0.279 x 0.991: 6 -1,-1.95; 7 -0.5,-1.95; 8 0,-1.95; 9 0.5,-1.95; 10 1,-1.95; 16 1,1.95; 17 0.5,1.95; 18 0,1.95; 19 -0.5,1.95; 20 -1,1.95 | smd 2.388 x 2.388: 21 0,0
YPA0008AGAE = smd 0.254 x 0.254: A1 -0.5,0.75; A2 0.5,0.75; B1 -0.5,0.25; B2 0.5,0.25; C1 -0.5,-0.25; C2 0.5,-0.25; D1 -0.5,-0.75; D2 0.5,-0.75
RGE24_2P1X2P1 = smd 0.838 x 0.279: 1 -1.975,1.25; 2 -1.975,0.75; 3 -1.975,0.25; 4 -1.975,-0.25; 5 -1.975,-0.75; 6 -1.975,-1.25; 13 1.975,-1.25; 14 1.975,-0.75; 15 1.975,-0.25; 16 1.975,0.25; 17 1.975,0.75; 18 1.975,1.25 | smd 0.279 x 0.838: 7 -1.25,-1.975; 8 -0.75,-1.975; 9 -0.25,-1.975; 10 0.25,-1.975; 11 0.75,-1.975; 12 1.25,-1.975; 19 1.25,1.975; 20 0.75,1.975; 21 0.25,1.975; 22 -0.25,1.975; 23 -0.75,1.975; 24 -1.25,1.975 | smd 2.108 x 2.108: 25 0,0
DRL0006A = smd 0.508 x 0.305: 1 -0.75,0.5; 2 -0.75,0; 3 -0.75,-0.5; 4 0.75,-0.5; 5 0.75,0; 6 0.75,0.5
DDC0006A_N = smd 1.575 x 0.559: 1 -1.168,0.95; 2 -1.168,0; 3 -1.168,-0.95; 4 1.168,-0.95; 5 1.168,0; 6 1.168,0.95
L3225P = smd 1.8 x 2: 1 -1.4,0; 2 1.4,0
L2012C = smd 1 x 1: 1 -1,0; 2 1,0
1X06 = drill 1.016 long: 1 -6.35,0; 2 -3.81,0; 3 -1.27,0; 4 1.27,0; 5 3.81,0; 6 6.35,0
1X04 = drill 1.016 long: 1 -3.81,0; 2 -1.27,0; 3 1.27,0; 4 3.81,0
R0603 = smd 1 x 1.1: 1 -0.85,0; 2 0.85,0
SKHMPXE010 = smd 1.6 x 1.4: 1 -4.2,2.25; 2 4.2,2.25; 3 -4.2,-2.25; 4 4.2,-2.25; 5 4.2,0
W3013-INV = smd 1.7 x 1.45: 1 0.845,2.875; 2 0.845,1.125 | smd 1.7 x 3.2: 3 9.945,2
3.2X2.5MM = smd 1.4 x 1.2: 1 -1.1,-0.85; 2 1.1,-0.85; 3 1.1,0.85; 4 -1.1,0.85

### Placement (x,y rotation side)
!PROG  34.92,19.68 270 top
ADRESS  7.94,5.87 0 top
BAT  31.11,18.1 90 top
C100  4.76,27.3 180 top
C101  8.73,24.45 270 top
C200  24.77,6.67 180 top
C201  24.77,9.84 270 top
C210  34.92,9.84 270 top
C240  27.78,18.57 180 top
C241  27.78,16.99 180 top
C300  20.95,39.85 90 top
C301  25.24,31.59 0 top
C302  30.32,35.08 0 top
C310  30.32,37.31 0 top
C320  28.42,41.43 90 top
C321  23.02,41.43 270 top
C350  14.45,35.08 45 top
C351  14.61,38.26 270 top
C352  14.76,41.43 45 top
C400  12.22,27.94 270 top
C500  10.79,19.05 0 top
C501  6.03,19.05 180 top
C510  13.97,19.05 0 top
C600  15.24,24.13 270 top
C700  26.99,26.04 90 top
F300  20.8,36.04 0 top
IC100  6.35,24.77 270 top
IC200  29.84,11.75 0 top
IC300  24.92,35.72 180 top
IC400  14.29,27.94 0 top
IC500  8.89,15.24 0 top
IC600  13.02,24.13 0 top
IC700  23.81,26.04 180 top
L200  24.77,14.29 90 top
L210  34.92,14.29 270 top
L350  17.78,35.16 180 top
LINK  20.64,8.26 270 top
PROG  16.83,5.71 90 top
R200  25.08,19.21 270 top
R201  22.07,20.32 180 top
R210  24.77,4.13 180 top
R211  24.77,1.59 180 top
R220  28.57,1.59 180 top
R221  28.57,4.13 0 top
R222  28.57,6.67 180 top
R230  32.38,4.13 180 top
R231  32.38,6.67 0 top
R300  22.07,32.23 0 top
R500  13.65,4.45 270 top
R510  21.11,17.62 90 top
R511  18.89,17.62 90 top
R700  29.21,27.15 270 top
R710  23.81,22.86 270 top
R711  20.48,24.29 90 top
S1  33.97,27.94 270 top
U$1  12.7,44.13 180 top
X320  25.88,41.59 270 top

### Tracks (layer width: path | path; a pad name or v marks a point on that pad's centre or on a via)
!CC110L_CS  (via drill 0.3 pad 0.6)
  Top 0.254: v26.51,38.58 25.72,38.58 25.42,38.28 | 25.42,38.28 25.42,38.12 | 25.42,38.12 25.42,38.28 | 25.42,38.28 25.42,38.12 | 25.42,38.12 IC300.7 | v3.65,12.38 7.3,12.38 7.62,12.7 7.64,12.72 IC500.7
  Bottom 0.254: v26.51,38.58 26.51,31.27 25.88,30.64 3.33,30.64 0.64,27.94 0.64,15.4 v3.65,12.38
!HDC1000_INT  (via drill 0.3 pad 0.6)
  Top 0.254: v10.32,30 10.48,30.16 15.08,30.16 16.19,29.05 16.19,28.1 16.19,26.67 15.88,26.35 14.92,26.35 14.79,26.49 IC400.D2 | v1.75,16.35 2.61,15.49 IC500.3
  Bottom 0.254: v10.32,30 10.16,30.16 8.89,30.16 3.49,30.16 1.11,27.78 1.11,16.99 v1.75,16.35
!LINK_INT  (via drill 0.3 pad 0.6)
  Top 0.254: IC500.5 2.74,14.49 v1.27,13.02
  Bottom 0.254: v1.27,13.02 1.27,6.19 6.35,1.11 13.18,1.11 15.24,3.17 19.37,3.17 LINK.6
!MSP430_RST
  Top 0.254: PROG.3 15.34,6.99 R500.1 13.65,10 10.64,13.02 10.39,13.27 IC500.12
!TMP102_ALERT  (via drill 0.3 pad 0.6)
  Top 0.254: IC600.3 10.66,23.63 9.84,24.45 9.84,26.35 9.84,27.3 9.84,29.37 v9.68,29.53 | v2.7,17.3 3.51,16.49 IC500.1
  Bottom 0.254: v9.68,29.53 9.05,28.89 8.57,28.89 8.1,28.89 3.49,28.89 2.06,27.46 2.06,17.94 2.54,17.46 v2.7,17.3
ADRESS_0
  Top 0.254: ADRESS.6 5.92,10.37 7.14,11.59 7.46,11.91 8.14,12.59 IC500.8
ADRESS_1
  Top 0.254: ADRESS.5 7.94,11.43 8.64,12.13 IC500.9
BQ25570_VBAT_OK  (via drill 0.3 pad 0.6)
  Top 0.254: IC200.13 33.02,11.75 33.97,10.79 33.97,8.26 34.61,7.62 34.61,3.81 31.43,0.64 v15.24,0.64 | IC500.4 2.29,14.99 v1.11,13.81
  Bottom 0.254: v1.11,13.81 0.64,13.34 0.64,6.03 6.03,0.64 14.29,0.64 14.92,0.64 v15.24,0.64
BQ25570_VOUT_EN  (via drill 0.3 pad 0.6)
  Top 0.254: IC200.6 28.59,9.84 v26.99,9.84 | v25.56,17.3 25.56,17.88 R200.2 23.12,20.32 R201.1
  Bottom 0.254: v26.99,9.84 25.56,11.27 v25.56,17.3
BQ25570_VSTOR  (via drill 0.3 pad 0.6)
  Top 0.254: IC200.3 26.99,11.75 v26.51,11.27 | IC200.19 29.34,14.15 29.21,14.29 v28.42,15.08
  Top 0.4: S1.3 31.72,31.09 v31.43,30.8
  Top 0.406: R710.2 25.82,22.01 | 25.82,22.01 26.67,22.86 26.99,23.18 C700.1 | C700.1 26.89,25.09 IC700.1 | S1.4 30.28,25.18 | 30.28,25.18 C700.1 | 25.82,22.01 25.08,22.01 R200.1 26.35,18.79 26.57,18.57 C240.2 C241.2 26.93,16.57 v28.42,15.08 | 30.28,25.18 30.28,25.2 v31.43,26.35
  Bottom 0.254: v26.51,11.27 26.51,13.18 v28.42,15.08
  Bottom 0.4: v31.43,30.8 v31.43,26.35
CC110L_GDO0  (via drill 0.3 pad 0.6)
  Top 0.254: v8.73,18.73 9.14,18.32 IC500.21 | IC300.6 27.42,37.67 v27.78,37.31
  Bottom 0.254: v27.78,37.31 27.78,31.43 27.78,30.96 26.51,29.69 11.75,29.69 10,27.94 8.41,27.94 8.26,27.94 8.1,27.94 7.78,27.94 3.81,27.94 3.02,27.15 3.02,19.53 3.81,18.73 v8.73,18.73
CC110L_GDO2
  Top 0.254: IC300.3 27.62,35.72 28.26,35.08 28.26,30.96 28.26,30.8 26.04,28.57 19.53,28.57 18.89,27.94 18.89,27.46 18.89,22.6 R511.2
DEVICE
  Top 0.254: ADRESS.4 10.48,10.79 9.21,12.06 9.14,12.13 IC500.10
GND  (via drill 0.3, 0.3 pad 0.6, 0.6)
  Top 0.2: IC200.1 27.57,12.75 26.51,13.81
  Top 0.254: IC200.21 v29.37,12.22 28.84,12.75 IC200.1 27.89,12.75 | IC200.5 28.84,10.75 v29.37,11.27 IC200.21 | IC200.15 30.84,12.75 v30.32,12.22 | v30.32,12.22 IC200.21 | C301.2 25.42,32.26 IC300.19 25.42,35.22 IC300.21 | 23.39,33.77 IC300.16 23.92,34.72 v24.13,34.92 | IC500.23 8.14,15.99 v8.41,15.72 IC500.25 v9.37,15.72 10.14,16.49 IC500.19 10.14,17.55 C500.2 | 8.3,23.86 IC100.5 | v32.54,35.08 C302.2 | C501.2 5.08,19.15 | IC200.17 30.34,12.25 v30.32,12.22 | C400.2 12.82,27.69 IC400.C1 IC400.D1 | IC200.9 30.34,11.25 IC200.21
  Top 0.61: ADRESS.1 ADRESS.2 | v35.56,7.62 35.56,8.36 C210.2
  other vias: 29.53,7.78 31.43,7.62 19.84,32.23 18.57,43.66 21.91,41.75 30.64,41.12 32.54,37.31 5.24,23.02 30.8,14.92 26.51,2.06 24.92,35.72 24.92,34.92 25.72,34.92 25.72,35.72 24.13,35.72 24.13,36.51 24.92,36.51 25.72,36.51 8.41,14.76 9.37,14.76 30.32,11.27 9.84,23.5 5.71,22.54 7.3,22.54 13.65,22.54 13.02,25.88 5.08,25.88 6.35,24.77 17.14,23.18 0.79,43.5 5.08,35.24 8.26,35.24 16.19,38.89 18.57,37.62 16.19,38.1 20.8,33.97 1.43,43.02 1.43,42.23 1.43,41.43 1.43,40.64 1.43,39.85 1.43,39.05 1.43,38.26 17.14,41.75 13.18,42.86 18.41,36.83 21.27,33.5 16.67,41.12 16.67,42.39 1.43,35.88 13.02,38.58 17.46,36.83 13.65,43.5 13.02,36.83 13.02,37.62 13.02,39.37 13.02,35.24 13.02,36.04 1.43,36.67 1.43,37.47 11.43,35.24 3.49,35.24 7.46,35.24 1.91,35.24 2.7,35.24 9.84,35.24 10.64,35.24 16.19,39.69 16.19,37.31 20.8,37.94 16.19,40.48 16.67,36.83 20.8,36.04 12.22,35.24 19.37,37.62 20,37.94 19.21,36.83 16.03,43.02 9.05,35.24 5.87,35.24 4.29,35.24 6.67,35.24 18.26,41.12 18.41,39.37 30.64,40.01 30.64,42.39 20.95,42.55 6.67,20.48 11.11,23.02 9.68,22.54 13.81,20.48 15.4,20.48 12.86,17.46 13.02,16.67 12.22,16.67 16.03,15.72 13.97,10.79 14.29,10 12.7,12.06 14.92,7.78 26.67,1.43 20.64,22.07 13.34,11.43 22.7,8.57 23.34,5.71 31.59,5.4 11.43,13.34 12.06,12.7 14.29,9.21 22.7,9.37 33.34,22.07 22.07,23.5 28.57,7.78 33.34,25.24 14.45,8.41 16.03,33.5 16.83,33.5 17.62,33.5 18.41,33.5 19.21,33.5 20,33.5 18.89,38.42 14.45,43.81 15.4,43.5 11.91,34.61 12.38,33.97 13.02,33.34 12.7,34.61 13.81,32.86 14.76,32.86 15.4,33.18 11.11,24.29 14.61,20.48 32.54,36.2 32.54,38.58 31.27,39.05 25.88,41.59 22.86,38.26 23.02,33.34 5.4,5.87 7.94,3.33 10.48,4.6 7.94,6.35 5.4,3.65 26.35,13.97 33.18,13.97 32.38,13.18 28.57,5.71 29.21,16.03 29.53,17.78 25.08,24.13 25.08,23.18 25.88,23.81 30.48,27.3 30.48,26.51 21.59,27.94 22.38,27.94 23.18,27.94 23.97,27.94 24.77,27.94 17.62,16.35 17.62,17.14 17.62,18.1 17.62,18.89 17.62,19.68 18.26,20.32 17.14,22.38 14.29,23.02 17.14,23.97 17.14,24.77 17.14,25.56 17.78,14.76 17.78,13.97 17.78,13.18 18.1,12.54 18.73,11.91 19.37,10.95 15.56,26.99 25.72,32.54 28.1,27.15 28.1,26.35 11.43,25.88 12.22,25.88 13.02,20.48 5.24,18.1 11.11,17.94 12.06,20.32 10.32,18.1 8.73,20 8.26,20.48 7.46,20.48 5.87,20.48 5.08,20.48 4.92,21.11 19.53,27.62 19.53,26.83 20.32,26.83 27.15,28.73 27.78,29.37 28.42,30 29.05,30.64 29.05,31.43 29.05,32.23 29.05,33.02 29.05,33.81 17.78,29.05 29.21,19.53 27.3,13.02
  pour Top (rank 3, no thermals): 0,44.61 0,0 38.1,0 38.1,44.61
  pour Bottom (no thermals): 0,44.61 0,0 38.1,0 38.1,44.61
  pour Top (isolate 0.2, rank 2, no thermals): 0,44.61 0,34.61 11.75,34.61 11.75,32.23 21.43,32.23 21.43,37.94 17.94,37.94 17.94,44.61
LPS25H_INT  (via drill 0.3 pad 0.6)
  Top 0.254: IC100.7 7.6,25.07 7.78,25.24 7.78,26.99 7.78,28.42 v6.67,29.53 | IC500.2 4.24,15.99 3.06,15.99 v1.91,17.14
  Bottom 0.254: v6.67,29.53 6.51,29.69 | 6.51,29.69 5.87,29.69 | 5.87,29.69 6.51,29.69 | 6.51,29.69 5.87,29.69 | 5.87,29.69 3.65,29.69 1.59,27.62 1.59,17.78 1.59,17.46 v1.91,17.14
MSP430_CLK  (via drill 0.3 pad 0.6)
  Top 0.254: IC500.6 3.67,13.99 v3.49,13.81 | v27.15,33.97 27.15,34.72 IC300.1
  Bottom 0.254: v3.49,13.81 3.49,17.46 2.54,18.41 2.54,27.3 3.65,28.42 7.94,28.42 8.41,28.42 9.68,28.42 11.43,30.16 17.46,30.16 26.19,30.16 27.15,31.11 v27.15,33.97
MSP430_MISO  (via drill 0.3 pad 0.6)
  Top 0.254: IC500.14 13.61,14.49 v14.29,13.81 | v17.78,20.95 18.41,21.59 18.41,27.94 18.41,28.1 19.37,29.05 25.88,29.05 27.78,30.96 27.78,34.45 27.78,34.92 27.49,35.22 IC300.2
  Bottom 0.254: v14.29,13.81 14.29,17.46 14.45,17.62 v17.78,20.95
MSP430_MOSI  (via drill 0.3 pad 0.6)
  Top 0.254: IC500.13 12.68,13.99 v13.65,13.02 | IC300.20 25.92,33.29 26.67,32.54 26.83,32.38 26.99,32.23 26.99,30.8 25.72,29.53 19.21,29.53 17.78,28.1 17.78,27.78 v17.78,21.91
  Bottom 0.254: v13.65,13.02 13.65,17.78 16.99,21.11 17.3,21.43 v17.78,21.91
MSP430_P2.2
  Top 0.254: IC500.15 14.99,14.99 16.89,14.99 17.11,14.99 R511.1 R510.1
MSP430_SCL  (via drill 0.3 pad 0.6)
  Top 0.254: IC500.17 14.4,15.99 v14.92,16.51 16.51,18.1 16.51,20.95 16.19,21.27 v10.48,21.27 5.71,21.27 4.45,22.54 4.45,23.5 4.45,23.97 4.76,24.29 4.94,24.46 IC100.2 | v14.92,14.29 14.92,13.18 14.92,11.11 14.92,9.05 15.72,8.26 18.1,8.26 18.73,7.62 18.73,6.35 LINK.5 | IC400.A1 13.79,29.39 13.65,29.53 13.49,29.69 12.7,29.69 11.43,29.69 10.79,29.05 10.48,28.73 10.48,27.94 10.48,26.99 v10.48,25.88 11.72,24.63 IC600.1
  Bottom 0.254: v14.92,16.51 v14.92,14.29 | v10.48,21.27 v10.48,25.88
MSP430_SDA  (via drill 0.3 pad 0.6)
  Top 0.254: IC400.A2 14.4,28.69 14.29,28.57 14.29,26.35 13.97,26.04 13.77,25.83 IC600.6 13.36,24.63 13.02,24.29 13.02,24.13 13.02,22.86 13.02,21.91 | IC500.16 14.86,15.49 v16.99,17.62 16.99,21.11 16.99,21.43 16.51,21.91 13.97,21.91 13.02,21.91 | v16.99,14.29 16.99,12.7 18.57,11.11 18.73,10.95 18.73,8.89 LINK.4 | 13.02,21.91 6.99,21.91 6.35,22.54 IC100.4
  Bottom 0.254: v16.99,17.62 v16.99,14.29
MSP430_TEST
  Top 0.254: IC500.11 9.64,12.74 10.16,12.22 10.79,12.22 11.75,11.27 11.75,8.26 11.75,5.4 12.7,4.45 14.29,4.45 14.61,4.45 14.92,4.45 PROG.2
MSP430_VCORE
  Top 0.254: IC500.18 13.12,18.75 C510.1
N$1
  pour Top (isolate 0.2, no thermals): 14.05,38.42 15.15,38.42 15.15,39.71 arc90 13.05,41.81 11.1,41.81 11.1,40.71 13.05,40.71 arc-90 14.05,39.71
N$2
  pour Top (isolate 0.2, no thermals): 17.98,35.72 17.98,34.62 20.25,34.62 20.25,35.72
N$7
  Top 0.4: S1.2 S1.1
  Top 0.406: IC700.3 25.99,28 R700.1 31.97,28 S1.2
N$14
  Top 0.254: R221.2 R220.1 31.11,1.59 32.38,2.86 32.38,7.94 31.11,9.21 30.84,9.48 IC200.10
N$15
  Top 0.254: R230.2 30.48,5.18 30.48,5.4 | 30.48,5.4 30.48,7.94 29.84,8.57 IC200.8 | R210.1 26.89,2.86 27.94,2.86 | 27.94,2.86 28.57,2.86 28.57,4.76 29.21,5.4 30.48,5.4 | 27.94,2.86 27.73,2.86 R220.2
N$16
  Top 0.254: R211.2 R210.2 23.91,4.87 24.13,5.08 24.45,5.4 24.77,5.4 26.04,5.4 26.67,6.03 26.67,8.57 27.46,9.37 29.05,9.37 29.34,9.66 IC200.7
N$17  (via drill 0.3 pad 0.6)
  Top 0.254: R221.1 R222.2 27.73,8.04 v28.42,8.73 | IC200.11 32.12,10.75 32.38,10.48 v32.38,9.84
  Bottom 0.254: v32.38,9.84 32.38,9.21 31.91,8.73 v28.42,8.73
N$18
  pour Top (no thermals): 28.89,13.65 26.04,16.51 23.97,16.51 23.97,14.76 26.35,14.76 27.94,13.18 28.89,13.18
N$19
  Top 0.254: C200.1 25.61,9.42 26.19,10 26.83,10.64 27.44,11.25 IC200.4
N$21
  Top 0.254: IC200.12 32.25,11.25 33.02,10.48 33.23,10.26 R231.2 R230.1
N$22
  Top 0.254: L210.2 35.05,13.02
  Top 0.406: 36.51,14.61 36.51,14.47
  pour Top (no thermals): 31.27,12.38 31.27,12.06 33.34,12.06 34.45,10.95 34.45,10.16 35.88,10.16 35.88,13.34 36.83,14.29 36.83,17.14 36.2,17.78 36.2,19.05 35.88,19.37 33.97,19.37 33.66,19.05 33.66,17.78 33.97,17.46 35.4,17.46 36.2,16.67 36.2,14.45 35.72,13.97 34.13,13.97 32.54,12.38
N$25
  pour Top (no thermals): 30.8,13.65 30.8,13.18 31.59,13.18 33.18,14.76 35.72,14.76 35.72,16.51 33.66,16.51
N$26
  Top 0.254: IC200.18 29.84,15.56 BAT.1
N$29
  Top 0.254: X320.3 26.73,40.06 | IC300.8 24.92,38.42 26.73,40.22 X320.3 | C320.1 28.32,40.49 X320.3
N$34
  Top 0.254: IC300.13 22,35.72 F300.3
N$35
  Top 0.254: IC300.12 22.14,36.22 F300.4
N$36
  pour Top (isolate 0.2, no thermals): 15.15,37.94 15.15,36.72 arc90 16.16,35.72 17.58,35.72 17.58,34.62 16.16,34.62 arc-90 14.05,36.72 14.05,37.94
N$40
  Top 0.254: C310.1 28.88,36.72 IC300.5
N$41
  Top 0.254: IC300.17 24.42,33.26 | 24.42,33.26 24.42,33.16 | 24.42,33.16 24.42,33.26 | 24.42,33.26 24.42,33.16 | 24.42,33.16 23.5,32.23 R300.2
N$49
  Top 0.254: IC300.10 23.92,39.32 23.97,39.37 23.97,41.33 C321.1
  Top 0.3: C321.1 23.43,42.69 X320.1
SOLAR_P
  Top 0.254: 24,13.65 L200.1
  pour Top (no thermals): 19.05,15.4 19.05,13.65 21.75,13.65 24.13,11.27 24.13,10.16 25.24,10.16 25.24,10.79 26.51,12.06 28.42,12.06 28.42,12.38 27.15,12.38 25.72,13.81 23.81,13.81 22.23,15.4
TPL5010_RST_N
  Top 0.406: R711.2 20.53,25.09 21.91,25.09 | 21.91,25.09 IC700.6 | R710.1 22.44,25.09 21.91,25.09
TPL5111_DONE  (via drill 0.3 pad 0.6)
  Top 0.254: IC500.22 8.64,17.71 8.26,18.1 8.1,18.26 8.1,18.89 v8.1,19.37 | v20.32,27.94 21.27,26.98 IC700.4
  Bottom 0.254: v8.1,19.37 5.08,19.37 4.29,20.16 4.29,26.04 4.92,26.67 10.79,26.67 12.38,28.26 20,28.26 v20.32,27.94
TPL5111_DRV
  Top 0.254: IC700.5 19.68,26.04 19.37,25.72 19.37,22.17 R201.2 21.11,20.22 R510.2
VCC  (via drill 0.3, 0.3 pad 0.6)  (2 unrouted)
  Top 0.254: IC300.11 22.97,36.98 C300.1 22.49,39 v22.54,39.05 | C302.1 28.34,36.22 IC300.4 | IC300.18 24.92,32.12 C301.1 | 5.75,27.3 C100.1 5.75,27.17 IC100.10 5.75,25.36 IC100.1 | IC600.5 14.39,24.13 C600.1 15.5,25.24 | C501.1 7.64,18.29 IC500.24 | IC500.20 9.64,18.75 C500.1 | C101.1 7.9,24.46 IC100.6 | IC300.9 24.42,38.87 v24.61,39.05 | IC400.B1 12.82,28.19 C400.1 | v9.21,27.3 9.21,25.72 8.57,25.08
  Top 0.3: v22.07,31.27 v22.07,33.81 22.38,33.81 22.86,34.29 22.97,34.4 IC300.15 IC300.14
  Top 0.4: v4.45,17.46 6.03,17.46 6.67,18.1 6.88,18.31 C501.1
  Top 0.406: 6.88,18.99 C501.1 | C302.1 29.47,34.66 30.32,33.81 30.48,33.66 v33.66,33.66 | C301.1 24.39,31.38 24.29,31.27 23.97,31.27 v22.07,31.27 19.05,31.27 v16.83,29.05 16.83,26.57 15.5,25.24 | v11.11,27.94 11.96,28.79 C400.1 | LINK.3 22.54,7.62 22.54,5.4 v22.54,1.27
  Top 0.61: PROG.1 15.14,3.6 R500.2 9.11,3.6 v4.45,8.26 | v4.45,17.46 3.65,18.26 v3.65,20.16 | v6.67,27.3 6.35,27.3 5.75,27.3 C100.1 | v20.32,43.81 19.37,42.86 19.37,39.69 20,39.05 20.06,39 C300.1
  Bottom 0.254: v24.61,39.05 24.45,39.05 24.29,39.05 v22.54,39.05
  Bottom 0.406: v22.54,1.27 22.54,0.64 | v33.66,33.66 37.31,33.66
  Bottom 0.61: PROG.1 18.1,0.64 22.54,0.64 31.59,0.64 37.31,6.35 37.31,18.57 !PROG.1 37.31,23.34 37.31,24.92 37.31,33.66 37.31,38.1 31.59,43.81 29.37,43.81 v20.32,43.81 | v4.45,8.26 v4.45,17.46 | v3.65,20.16 3.65,26.35 4.6,27.3 v6.67,27.3 v9.21,27.3 9.84,27.3 10.48,27.3 v11.11,27.94 12.22,29.05 v16.83,29.05